# EAGLE design MomoinololuM3[Rev1.1] (EAGLE 6.3)
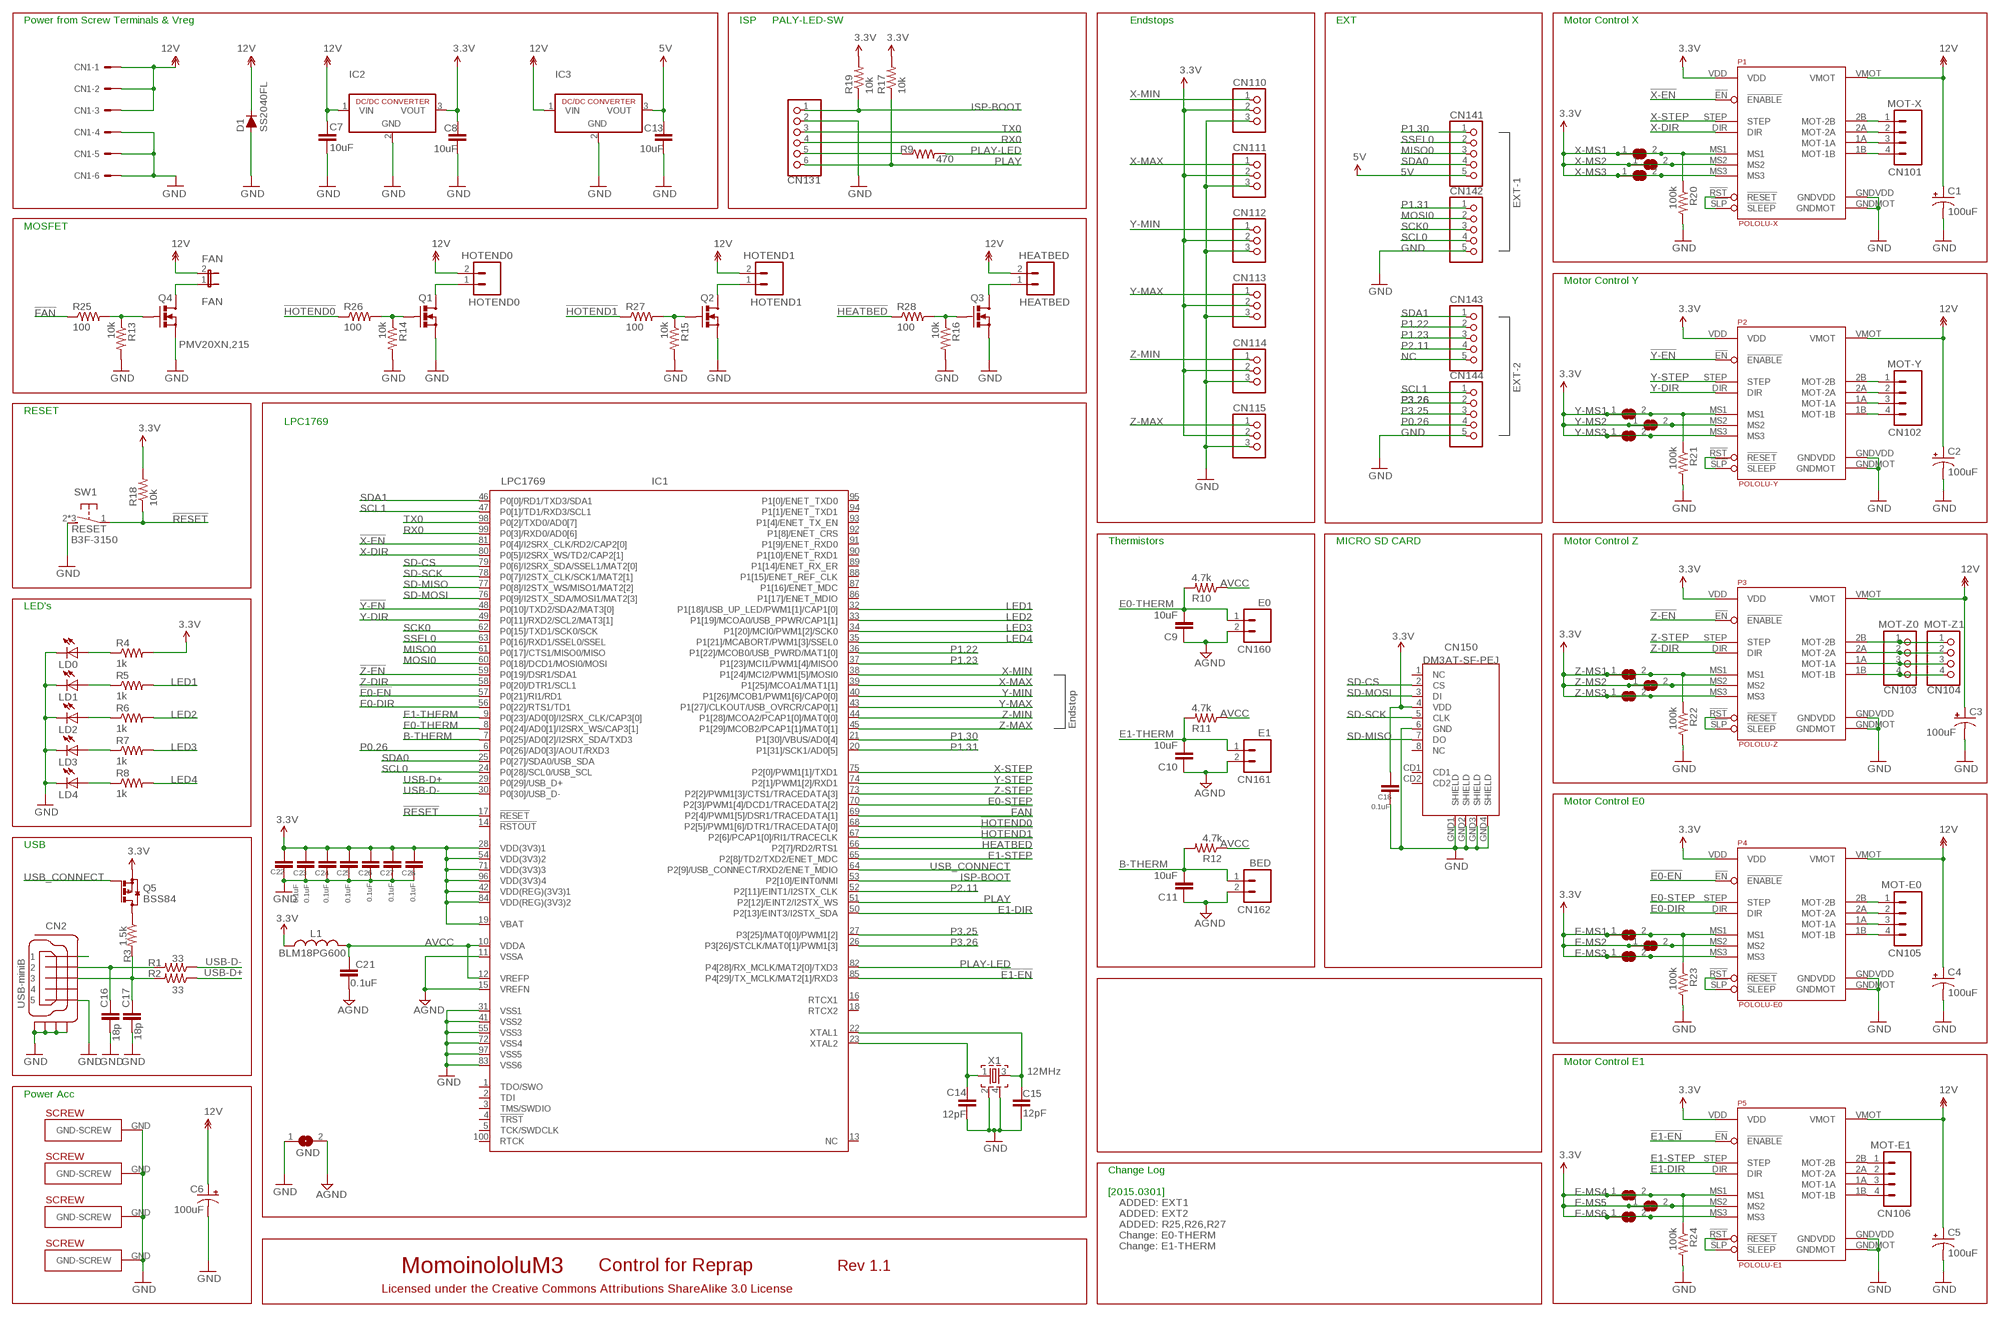
[diagram p0: schematic, sheet 1]

## Parts
C1  100uF  CPOL-USUD-6,3X7,7  [UD-6,3X7,7_NICHICON]
C2  100uF  CPOL-USUD-6,3X7,7  [UD-6,3X7,7_NICHICON]
C3  100uF  CPOL-USUD-6,3X7,7  [UD-6,3X7,7_NICHICON]
C4  100uF  CPOL-USUD-6,3X7,7  [UD-6,3X7,7_NICHICON]
C5  100uF  CPOL-USUD-6,3X7,7  [UD-6,3X7,7_NICHICON]
C6  100uF  CPOL-USUD-6,3X7,7  [UD-6,3X7,7_NICHICON]
C7  10uF  RCL_C-EUC1206K  [RCL_C1206K]
C8  10uF  RCL_C-EUC1206K  [RCL_C1206K]
C9  10uF  RCL_C-EUC1206K  [RCL_C1206K]
C10  10uF  RCL_C-EUC1206K  [RCL_C1206K]
C11  10uF  RCL_C-EUC1206K  [RCL_C1206K]
C13  10uF  RCL_C-EUC1206K  [RCL_C1206K]
C14  12pF  C-EUC0603  [C0603]
C15  12pF  C-EUC0603  [C0603]
C16  18p  C-EUC0603  [C0603]
C17  18p  C-EUC0603  [C0603]
C18  0.1uF  C-EUC0603  [C0603]
C21  0.1uF  C-EUC0603  [C0603]
C22  0.1uF  C-EUC0603  [C0603]
C23  0.1uF  C-EUC0603  [C0603]
C24  0.1uF  C-EUC0603  [C0603]
C25  0.1uF  C-EUC0603  [C0603]
C26  0.1uF  C-EUC0603  [C0603]
C27  0.1uF  C-EUC0603  [C0603]
C28  0.1uF  C-EUC0603  [C0603]
CN1  556X-6H  [5569-6]
CN2  USB-miniB  CON-HIROSE_MINI-USB-SHIELD-UX60A-MB-5ST  [CON-HIROSE_UX60A-MB-5ST]
CN101  MOT-X  SPARKFUN_M04POLAR  [SPARKFUN_MOLEX-1X4]
CN102  MOT-Y  SPARKFUN_M04POLAR  [SPARKFUN_MOLEX-1X4]
CN103  MOT-Z0  PINHD-1X4  [1X04]
CN104  MOT-Z1  PINHD-1X4  [1X04]
CN105  MOT-E0  SPARKFUN_M04POLAR  [SPARKFUN_MOLEX-1X4]
CN106  MOT-E1  SPARKFUN_M04POLAR  [SPARKFUN_MOLEX-1X4]
CN110  PINHD-1X3  [1X03]
CN111  PINHD-1X3  [1X03]
CN112  PINHD-1X3  [1X03]
CN113  PINHD-1X3  [1X03]
CN114  PINHD-1X3  [1X03]
CN115  PINHD-1X3  [1X03]
CN131  PINHD-1X6  [1X06]
CN141  PINHD-1X5  [1X05]
CN142  PINHD-1X5  [1X05]
CN143  PINHD-1X5  [1X05]
CN144  PINHD-1X5  [1X05]
CN150  DM3AT-SF-PEJ  [DM3AT-SF-PEJ]
CN160  E0  SPARKFUN_M02PTH  [SPARKFUN_1X02]
CN161  E1  SPARKFUN_M02PTH  [SPARKFUN_1X02]
CN162  BED  SPARKFUN_M02PTH  [SPARKFUN_1X02]
D1  SS2040FL  SEMICON-SMD-IPC_D-FILL-SOD123  [SEMICON-SMD-IPC_SOD123]
E-MS1  SJ  [SJ]
E-MS2  SJ  [SJ]
E-MS3  SJ  [SJ]
E-MS4  SJ  [SJ]
E-MS5  SJ  [SJ]
E-MS6  SJ  [SJ]
FAN  FAN  SPARKFUN_JUMPER-2PTH  [SPARKFUN_1X02]
GND  SJ  [SJ]
HEATBED  HEATBED  SPARKFUN_M025.08MM  [SCREWTERMINAL-5.08MM-2]
HOLE1  PLATED-SCREW  [PLATEDSCREW]
HOLE2  PLATED-SCREW  [PLATEDSCREW]
HOLE3  PLATED-SCREW  [PLATEDSCREW]
HOLE4  PLATED-SCREW  [PLATEDSCREW]
HOTEND0  HOTEND0  SPARKFUN_M025.08MM  [SCREWTERMINAL-5.08MM-2]
HOTEND1  HOTEND1  SPARKFUN_M025.08MM  [SCREWTERMINAL-5.08MM-2]
IC1  LPC1769  LPC1768  [LQFP100-14X14]
IC2  R-78E3.3-0.5  R-78C3.3-1.0  [SIP3]
IC3  R-78E5.0-0.5  R-78C3.3-1.0  [SIP3]
L1  BLM18PG600  L-USL2012C  [L2012C]
LD0  LEDSML0805  [SML0805]
LD1  LEDSML0805  [SML0805]
LD2  LEDSML0805  [SML0805]
LD3  LEDSML0805  [SML0805]
LD4  LEDSML0805  [SML0805]
P1  POLOLU-X  POLOLU-ALLEGRO_POLOLU-ALLEGRO  [POLOLU-ALLEGRO_POLOLU-ALLEGRO-PTH]
P2  POLOLU-Y  POLOLU-ALLEGRO_POLOLU-ALLEGRO  [POLOLU-ALLEGRO_POLOLU-ALLEGRO-PTH]
P3  POLOLU-Z  POLOLU-ALLEGRO_POLOLU-ALLEGRO  [POLOLU-ALLEGRO_POLOLU-ALLEGRO-PTH]
P4  POLOLU-E0  POLOLU-ALLEGRO_POLOLU-ALLEGRO  [POLOLU-ALLEGRO_POLOLU-ALLEGRO-PTH]
P5  POLOLU-E1  POLOLU-ALLEGRO_POLOLU-ALLEGRO  [POLOLU-ALLEGRO_POLOLU-ALLEGRO-PTH]
Q1  PSMN038-100YLX  SPARKFUN_MOSFET-NCHANNELSOT669  [SOT669]
Q2  PSMN038-100YLX  SPARKFUN_MOSFET-NCHANNELSOT669  [SOT669]
Q3  PSMN038-100YLX  SPARKFUN_MOSFET-NCHANNELSOT669  [SOT669]
Q4  PMV20XN,215  SPARKFUN_MOSFET-NCHANNELSMD  [SPARKFUN_SOT23-3]
Q5  BSS84  [SOT23]
R1  33  R-US_R0603  [R0603]
R2  33  R-US_R0603  [R0603]
R3  1.5k  R-US_R0603  [R0603]
R4  1k  R-US_R0603  [R0603]
R5  1k  R-US_R0603  [R0603]
R6  1k  R-US_R0603  [R0603]
R7  1k  R-US_R0603  [R0603]
R8  1k  R-US_R0603  [R0603]
R9  470  R-US_R0603  [R0603]
R10  4.7k  R-US_R0603  [R0603]
R11  4.7k  R-US_R0603  [R0603]
R12  4.7k  R-US_R0603  [R0603]
R13  10k  R-US_R0603  [R0603]
R14  10k  R-US_R0603  [R0603]
R15  10k  R-US_R0603  [R0603]
R16  10k  R-US_R0603  [R0603]
R17  10k  R-US_R0603  [R0603]
R18  10k  R-US_R0603  [R0603]
R19  10k  R-US_R0603  [R0603]
R20  100k  R-US_R0603  [R0603]
R21  100k  R-US_R0603  [R0603]
R22  100k  R-US_R0603  [R0603]
R23  100k  R-US_R0603  [R0603]
R24  100k  R-US_R0603  [R0603]
R25  100  R-US_R0603  [R0603]
R26  100  R-US_R0603  [R0603]
R27  100  R-US_R0603  [R0603]
R28  100  R-US_R0603  [R0603]
SW1  B3F-3150  31-XX  [B3F-31XX]
X1  12MHz  FA-238  [FA-238]
X-MS1  SJ  [SJ]
X-MS2  SJ  [SJ]
X-MS3  SJ  [SJ]
Y-MS1  SJ  [SJ]
Y-MS2  SJ  [SJ]
Y-MS3  SJ  [SJ]
Z-MS1  SJ  [SJ]
Z-MS2  SJ  [SJ]
Z-MS3  SJ  [SJ]

## Nets
3.3V: C8.1 C18.2 C22.2 C23.2 C24.2 C25.2 C26.2 C27.2 C28.2 CN110.2 CN111.2 CN112.2 CN113.2 CN114.2 CN115.2 CN150.4(VDD) E-MS1.1 E-MS1.2 E-MS2.1 E-MS2.2 E-MS3.1 E-MS3.2 E-MS4.1 E-MS4.2 E-MS5.1 E-MS5.2 E-MS6.1 E-MS6.2 IC1.19(VBAT) IC1.28(VDD(3V3)1) IC1.42(VDD(REG)(3V3)1) IC1.54(VDD(3V3)2) IC1.71(VDD(3V3)3) IC1.84(VDD(REG)(3V3)2) IC1.96(VDD(3V3)4) IC2.3(VOUT) L1.1 P1.MS1 P1.MS2 P1.MS3 P1.VDD P2.MS1 P2.MS2 P2.MS3 P2.VDD P3.MS1 P3.MS2 P3.MS3 P3.VDD P4.MS1 P4.MS2 P4.MS3 P4.VDD P5.MS1 P5.MS2 P5.MS3 P5.VDD Q5.2(S) R4.2 R17.2 R18.2 R19.2 R20.1 R21.1 R22.1 R23.1 R24.1 X-MS1.1 X-MS1.2 X-MS2.1 X-MS2.2 X-MS3.1 X-MS3.2 Y-MS1.1 Y-MS1.2 Y-MS2.1 Y-MS2.2 Y-MS3.1 Y-MS3.2 Z-MS1.1 Z-MS1.2 Z-MS2.1 Z-MS2.2 Z-MS3.1 Z-MS3.2
5V: C13.1 CN141.5 IC3.3(VOUT)
12V: C1.+ C2.+ C3.+ C4.+ C5.+ C6.+ C7.1 CN1.1 CN1.2 CN1.3 D1.1(C) FAN.2 HEATBED.2 HOTEND0.2 HOTEND1.2 IC2.1(VIN) IC3.1(VIN) P1.VMOT P2.VMOT P3.VMOT P4.VMOT P5.VMOT
!E0-EN: IC1.57(P0[21]/RI1/RD1) P4.!EN(!ENABLE)
!E1-EN: IC1.85(P4[29]/TX_MCLK/MAT2[1]/RXD3) P5.!EN(!ENABLE)
!FAN: IC1.69(P2[4]/PWM1[5]/DSR1/TRACEDATA[1]) R25.1
!HEATBED: IC1.66(P2[7]/RD2/RTS1) R28.1
!HOTEND0: IC1.68(P2[5]/PWM1[6]/DTR1/TRACEDATA[0]) R26.1
!HOTEND1: IC1.67(P2[6]/PCAP1[0]/RI1/TRACECLK) R27.1
!RESET: IC1.17(!RESET) R18.1 SW1.1(P)
!X-EN: IC1.81(P0[4]/I2SRX_CLK/RD2/CAP2[0]) P1.!EN(!ENABLE)
!Y-EN: IC1.48(P0[10]/TXD2/SDA2/MAT3[0]) P2.!EN(!ENABLE)
!Z-EN: IC1.59(P0[19]/DSR1/SDA1) P3.!EN(!ENABLE)
AGND: C9.1 C10.1 C11.1 C21.2 CN160.2 CN161.2 CN162.2 GND.2 IC1.11(VSSA) IC1.15(VREFN)
AVCC: C21.1 IC1.10(VDDA) IC1.12(VREFP) L1.2 R10.1 R11.1 R12.1
B-THERM: C11.2 CN162.1 IC1.7(P0[25]/AD0[2]/I2SRX_SDA/TXD3) R12.2
E0-DIR: IC1.56(P0[22]/RTS1/TD1) P4.DIR
E0-STEP: IC1.70(P2[3]/PWM1[4]/DCD1/TRACEDATA[2]) P4.STEP
E0-THERM: C9.2 CN160.1 IC1.8(P0[24]/AD0[1]/I2SRX_WS/CAP3[1]) R10.2
E1-DIR: IC1.50(P2[13]/EINT3/I2STX_SDA) P5.DIR
E1-STEP: IC1.65(P2[8]/TD2/TXD2/ENET_MDC) P5.STEP
E1-THERM: C10.2 CN161.1 IC1.9(P0[23]/AD0[0]/I2SRX_CLK/CAP3[0]) R11.2
E-MOT-1A [power]: CN105.3 P4.1A(MOT-1A)
E-MOT-1A1 [power]: CN106.3 P5.1A(MOT-1A)
E-MOT-1B [power]: CN105.4 P4.1B(MOT-1B)
E-MOT-1B1 [power]: CN106.4 P5.1B(MOT-1B)
E-MOT-2A [power]: CN105.2 P4.2A(MOT-2A)
E-MOT-2A1 [power]: CN106.2 P5.2A(MOT-2A)
E-MOT-2B [power]: CN105.1 P4.2B(MOT-2B)
E-MOT-2B1 [power]: CN106.1 P5.2B(MOT-2B)
E-RESETSLEEP: P4.!RST(!RESET) P4.!SLP(!SLEEP)
E-RESETSLEEP1: P5.!RST(!RESET) P5.!SLP(!SLEEP)
GND: C1.- C2.- C3.- C4.- C5.- C6.- C7.2 C8.2 C13.2 C14.2 C15.2 C16.2 C17.2 C18.1 C22.1 C23.1 C24.1 C25.1 C26.1 C27.1 C28.1 CN1.4 CN1.5 CN1.6 CN2.5 CN2.M1(S1) CN2.M2(S2) CN2.M3(S3) CN2.M4(S4) CN110.3 CN111.3 CN112.3 CN113.3 CN114.3 CN115.3 CN131.2 CN142.5 CN144.5 CN150.6(GND) CN150.GND1(SHIELD) CN150.GND2(SHIELD) CN150.GND3(SHIELD) CN150.GND4(SHIELD) D1.2(A) GND.1 HOLE1.GND(GND-SCREW) HOLE2.GND(GND-SCREW) HOLE3.GND(GND-SCREW) HOLE4.GND(GND-SCREW) IC1.31(VSS1) IC1.41(VSS2) IC1.55(VSS3) IC1.72(VSS4) IC1.83(VSS6) IC1.97(VSS5) IC2.2(GND) IC3.2(GND) LD0.C LD1.C LD2.C LD3.C LD4.C P1.GNDMOT P1.GNDVDD P2.GNDMOT P2.GNDVDD P3.GNDMOT P3.GNDVDD P4.GNDMOT P4.GNDVDD P5.GNDMOT P5.GNDVDD Q1.1(S) Q1.2(S) Q1.3(S) Q2.1(S) Q2.2(S) Q2.3(S) Q3.1(S) Q3.2(S) Q3.3(S) Q4.2(S) R13.2 R14.2 R15.2 R16.2 R20.2 R21.2 R22.2 R23.2 R24.2 SW1.2(S) SW1.3(S) SW1.4(S) X1.2 X1.4
HEATBED-GND: HEATBED.1 Q3.MB(D)
HOTEND0-GND: HOTEND0.1 Q1.MB(D)
HOTEND-GND1: HOTEND1.1 Q2.MB(D)
ISP-BOOT: CN131.1 IC1.53(P2[10]/EINT0/NMI) R19.1
LED0: LD0.A R4.1
LED1: IC1.32(P1[18]/USB_UP_LED/PWM1[1]/CAP1[0]) R5.2
LED2: IC1.33(P1[19]/MCOA0/USB_PPWR/CAP1[1]) R6.2
LED3: IC1.34(P1[20]/MCI0/PWM1[2]/SCK0) R7.2
LED4: IC1.35(P1[21]/MCABORT/PWM1[3]/SSEL0) R8.2
MISO0: CN141.3 IC1.61(P0[17]/CTS1/MISO0/MISO)
MOSI0: CN142.2 IC1.60(P0[18]/DCD1/MOSI0/MOSI)
N$2: Q5.3(D) R3.1
N$3: Q4.1(G) R13.1 R25.2
N$4: Q1.4(G) R14.1 R26.2
N$5: FAN.1 Q4.3(D)
N$6: C16.1 CN2.2 R1.2
N$7: C17.1 CN2.3 R2.2 R3.2
N$8: Q2.4(G) R15.1 R27.2
N$9: CN131.5 R9.1
N$10: LD1.A R5.1
N$11: LD2.A R6.1
N$12: LD3.A R7.1
N$13: LD4.A R8.1
N$14: Q3.4(G) R16.1 R28.2
NC: CN143.5
P0.26: CN144.4 IC1.6(P0[26]/AD0[3]/AOUT/RXD3)
P1.22: CN143.2 IC1.36(P1[22]/MCOB0/USB_PWRD/MAT1[0])
P1.23: CN143.3 IC1.37(P1[23]/MCI1/PWM1[4]/MISO0)
P1.30: CN141.1 IC1.21(P1[30]/VBUS/AD0[4])
P1.31: CN142.1 IC1.20(P1[31]/SCK1/AD0[5])
P2.11: CN143.4 IC1.52(P2[11]/EINT1/I2STX_CLK)
P3.25: CN144.3 IC1.27(P3[25]/MAT0[0]/PWM1[2])
P3.26: CN144.2 IC1.26(P3[26]/STCLK/MAT0[1]/PWM1[3])
PLAY: CN131.6 IC1.51(P2[12]/EINT2/I2STX_WS) R17.1
PLAY-LED: IC1.82(P4[28]/RX_MCLK/MAT2[0]/TXD3) R9.2
RX0: CN131.4 IC1.99(P0[3]/RXD0/AD0[6])
SCK0: CN142.3 IC1.62(P0[15]/TXD1/SCK0/SCK)
SCL0: CN142.4 IC1.24(P0[28]/SCL0/USB_SCL)
SCL1: CN144.1 IC1.47(P0[1]/TD1/RXD3/SCL1)
SD-CS: CN150.2(CS) IC1.79(P0[6]/I2SRX_SDA/SSEL1/MAT2[0])
SD-MISO: CN150.7(DO) IC1.77(P0[8]/I2STX_WS/MISO1/MAT2[2])
SD-MOSI: CN150.3(DI) IC1.76(P0[9]/I2STX_SDA/MOSI1/MAT2[3])
SD-SCK: CN150.5(CLK) IC1.78(P0[7]/I2STX_CLK/SCK1/MAT2[1])
SDA0: CN141.4 IC1.25(P0[27]/SDA0/USB_SDA)
SDA1: CN143.1 IC1.46(P0[0]/RD1/TXD3/SDA1)
SSEL0: CN141.2 IC1.63(P0[16]/RXD1/SSEL0/SSEL)
TX0: CN131.3 IC1.98(P0[2]/TXD0/AD0[7])
USB-D+: IC1.29(P0[29]/USB_D+) R2.1
USB-D-: IC1.30(P0[30]/USB_D-) R1.1
USB_CONNECT: IC1.64(P2[9]/USB_CONNECT/RXD2/ENET_MDIO) Q5.1(G)
VBUS: CN2.1
X'TAL-IN: C15.1 IC1.22(XTAL1) X1.3
X'TAL-OUT: C14.1 IC1.23(XTAL2) X1.1
X-DIR: IC1.80(P0[5]/I2SRX_WS/TD2/CAP2[1]) P1.DIR
X-MAX: CN111.1 IC1.39(P1[25]/MCOA1/MAT1[1])
X-MIN: CN110.1 IC1.38(P1[24]/MCI2/PWM1[5]/MOSI0)
X-MOT-1A [power]: CN101.3 P1.1A(MOT-1A)
X-MOT-1B [power]: CN101.4 P1.1B(MOT-1B)
X-MOT-2A [power]: CN101.2 P1.2A(MOT-2A)
X-MOT-2B [power]: CN101.1 P1.2B(MOT-2B)
X-RESETSLEEP: P1.!RST(!RESET) P1.!SLP(!SLEEP)
X-STEP: IC1.75(P2[0]/PWM1[1]/TXD1) P1.STEP
Y-DIR: IC1.49(P0[11]/RXD2/SCL2/MAT3[1]) P2.DIR
Y-MAX: CN113.1 IC1.43(P1[27]/CLKOUT/USB_OVRCR/CAP0[1])
Y-MIN: CN112.1 IC1.40(P1[26]/MCOB1/PWM1[6]/CAP0[0])
Y-MOT-1A [power]: CN102.3 P2.1A(MOT-1A)
Y-MOT-1B [power]: CN102.4 P2.1B(MOT-1B)
Y-MOT-2A [power]: CN102.2 P2.2A(MOT-2A)
Y-MOT-2B [power]: CN102.1 P2.2B(MOT-2B)
Y-RESETSLEEP: P2.!RST(!RESET) P2.!SLP(!SLEEP)
Y-STEP: IC1.74(P2[1]/PWM1[2]/RXD1) P2.STEP
Z-DIR: IC1.58(P0[20]/DTR1/SCL1) P3.DIR
Z-MAX: CN115.1 IC1.45(P1[29]/MCOB2/PCAP1[1]/MAT0[1])
Z-MIN: CN114.1 IC1.44(P1[28]/MCOA2/PCAP1[0]/MAT0[0])
Z-MOT-1A [power]: CN103.3 CN104.3 P3.1A(MOT-1A)
Z-MOT-1B [power]: CN103.4 CN104.4 P3.1B(MOT-1B)
Z-MOT-2A [power]: CN103.2 CN104.2 P3.2A(MOT-2A)
Z-MOT-2B [power]: CN103.1 CN104.1 P3.2B(MOT-2B)
Z-RESETSLEEP: P3.!RST(!RESET) P3.!SLP(!SLEEP)
Z-STEP: IC1.73(P2[2]/PWM1[3]/CTS1/TRACEDATA[3]) P3.STEP
Unconnected: CN2.4 CN150.1(NC) CN150.8(NC) CN150.CD1 CN150.CD2 IC1.1(TDO/SWO) IC1.2(TDI) IC1.3(TMS/SWDIO) IC1.4(!TRST) IC1.5(TCK/SWDCLK) IC1.13(NC) IC1.14(!RSTOUT) IC1.16(RTCX1) IC1.18(RTCX2) IC1.86(P1[17]/ENET_MDIO) IC1.87(P1[16]/ENET_MDC) IC1.88(P1[15]/ENET_REF_CLK) IC1.89(P1[14]/ENET_RX_ER) IC1.90(P1[10]/ENET_RXD1) IC1.91(P1[9]/ENET_RXD0) IC1.92(P1[8]/ENET_CRS) IC1.93(P1[4]/ENET_TX_EN) IC1.94(P1[1]/ENET_TXD1) IC1.95(P1[0]/ENET_TXD0) IC1.100(RTCK)

## Notes on the sheet
- Power from Screw Terminals & Vreg | ISP | PALY-LED-SW | Endstops | EXT | Motor Control X
- EXT-1
- MOSFET
- Motor Control Y
- EXT-2
- RESET
- LPC1769
- RESET
- Thermistors | MICRO SD CARD | Motor Control Z
- LED's
- Endstop
- Motor Control E0
- USB
- Motor Control E1
- Power Acc
- Change Log
- [2015.0301]
- ADDED: EXT1
- ADDED: EXT2
- ADDED: R25,R26,R27
- Change: E0-THERM
- Change: E1-THERM
- MomoinololuM3 | Control for Reprap | Rev 1.1
- Licensed under the Creative Commons Attributions ShareAlike 3.0 License

## Library data of the parts
C1-C6 = rcl:CPOL-US: POLARIZED CAPACITOR, American symbol
C7-C11 C13 = Sanguinololu:RCL_C-EU: CAPACITOR, European symbol
C14-C18 C21-C28 = momoinololuM3:C-EU: CAPACITOR, European symbol
CN1 = con-molex-2:556X-6: Mini FIT JR connector 6 way
CN2 = Sanguinololu:CON-HIROSE_MINI-USB-SHIELD-: MINI USB Connector Source: http://www.hirose.co.jp/cataloge_hp/e24000019.pdf; OC_FARNELL: unknown; OC_NEWARK: unknown
CN101 CN102 CN105 CN106 = Sanguinololu:SPARKFUN_M04: Header 4 Standard 4-pin 0.1" header. Use with straight break away headers (SKU : PRT-00116), right angle break away headers (PRT-00553), swiss pins (PRT-00743), machine pins (PRT-00117), and female headers (PRT-00115). Molex polarized connector foot print use with SKU : PRT-08231 with associated crimp pins and housings.
CN103 CN104 = Sanguinololu:PINHD-1X4: PIN HEADER
CN110-CN115 = momoinololuM3:PINHD-1X3: PIN HEADER
CN131 = momoinololuM3:PINHD-1X6: PIN HEADER
CN141-CN144 = momoinololuM3:PINHD-1X5: PIN HEADER
CN150 = sd-card:DM3AT-SF-PEJ: HIROSE microSD socket DM3AT-SF-PEJ
CN160-CN162 = momoinololuM3:SPARKFUN_M02: Header 2 Standard 2-pin 0.1" header. Use with straight break away headers (SKU : PRT-00116), right angle break away headers (PRT-00553), swiss pins (PRT-00743), machine pins (PRT-00117), and female headers (PRT-00115). Molex polarized connector foot print use with SKU : PRT-08233 with associated crimp pins and housings.
D1 = Sanguinololu:SEMICON-SMD-IPC_D-FILL-: DIODE filled
E-MS1-E-MS6 GND X-MS1-X-MS3 Y-MS1-Y-MS3 Z-MS1-Z-MS3 = Sanguinololu:SJ: SMD solder JUMPER
FAN = Sanguinololu:SPARKFUN_JUMPER-2: Jumper Basic 0.1" spaced jumper. Use with breakaway headers.
HEATBED HOTEND0 HOTEND1 = Sanguinololu:SPARKFUN_M02: Header 2 Standard 2-pin 0.1" header. Use with straight break away headers (SKU : PRT-00116), right angle break away headers (PRT-00553), swiss pins (PRT-00743), machine pins (PRT-00117), and female headers (PRT-00115). Molex polarized connector foot print use with SKU : PRT-08233 with associated crimp pins and housings.
HOLE1-HOLE4 = momoinololuM3:PLATED-SCREW
IC1 = lpc1xxx-v6:LPC1768: LPC1768 100 MHz 32-bit ARM Cortex-M3 based microcontroller featuring a high level of integration and low power consumption. 512 kB Flash, 64 kB SRAM, USB Device/Host/OTG, 2 CAN, DAC, Ethernet MarcVl - Datasheet available on www.nxp.com
IC2 IC3 = momoinololuM3:R-78C*-1.0: INNOLINE DC/DC-Converter 1.0 AMP SIP3 Single Output Source: Data sheet <http://www.mikrocontroller.net/attachment/150645/157764-da-01-en-DC_DC_WANDLER_R_78C5_0_1_0.pdf>
L1 = rcl:L-US: INDUCTOR, American symbol
LD0 LD1-LD4 = led:LED: LED OSRAM: - CHIPLED LG R971, LG N971, LY N971, LG Q971, LY Q971, LO R971, LY R971 LH N974, LH R974 LS Q976, LO Q976, LY Q976 LO Q996 - Hyper CHIPLED LW Q18S LB Q993, LB Q99A, LB R99A - SideLED LS A670, LO A670, LY A670, LG A670, LP A670 LB A673, LV A673, LT A673, LW A673 LH A674 LY A675 LS A676, LA A676, LO A676, LY A676, LW A676 LS A679, LY A679, LG A679 - Hyper Micro SIDELED® LS Y876, LA Y876, LO Y876, LY Y876 LT Y87S - SmartLED LW L88C, LW L88S LB L89C, LB L89S, LG L890 LS L89K, LO L89K, LY L89K LS L896, LA L896, LO L896, LY L896 - TOPLED LS T670, LO T670, LY T670, LG T670, LP T670 LSG T670, LSP T670, LSY T670, LOP T670, LYG T670 LG T671, LOG T671, LSG T671 LB T673, LV T673, LT T673, LW T673 LH T674 LS T676, LA T676, LO T676, LY T676, LB T676, LH T676, LSB T676, LW T676 LB T67C, LV T67C, LT T67C, LS T67K, LO T67K, LY T67K, LW E67C LS E67B, LA E67B, LO E67B, LY E67B, LB E67C, LV E67C, LT E67C LW T67C LS T679, LY T679, LG T679 LS T770, LO T770, LY T770, LG T770, LP T770 LB T773, LV T773, LT T773, LW T773 LH T774 LS E675, LA E675, LY E675, LS T675 LS T776, LA T776, LO T776, LY T776, LB T776 LHGB T686 LT T68C, LB T68C - Hyper Mini TOPLED® LB M676 - Mini TOPLED Santana® LG M470 LS M47K, LO M47K, LY M47K Source: http://www.osram.convergy.de LUXEON: - LUMILED® LXK2-PW12-R00, LXK2-PW12-S00, LXK2-PW14-U00, LXK2-PW14-V00 LXK2-PM12-R00, LXK2-PM12-S00, LXK2-PM14-U00 LXK2-PE12-Q00, LXK2-PE12-R00, LXK2-PE12-S00, LXK2-PE14-T00, LXK2-PE14-U00 LXK2-PB12-K00, LXK2-PB12-L00, LXK2-PB12-M00, LXK2-PB14-N00, LXK2-PB14-P00, LXK2-PB14-Q00 LXK2-PR12-L00, LXK2-PR12-M00, LXK2-PR14-Q00, LXK2-PR14-R00 LXK2-PD12-Q00, LXK2-PD12-R00, LXK2-PD12-S00 LXK2-PH12-R00, LXK2-PH12-S00 LXK2-PL12-P00, LXK2-PL12-Q00, LXK2-PL12-R00 Source: www.luxeon.com KINGBRIGHT: KA-3528ASYC Source: www.kingbright.com
P1-P5 = Sanguinololu:POLOLU-ALLEGRO_POLOLU-ALLEGRO
Q1-Q3 = Sanguinololu:SPARKFUN_MOSFET-NCHANNEL
Q4 = momoinololuM3:SPARKFUN_MOSFET-NCHANNEL
Q5 = momoinololuM3:BSS84: P-CHANNEL MOS FET
R1-R28 = rcl:R-US_: RESISTOR, American symbol
SW1 = momoinololuM3:31-XX: OMRON SWITCH; MPN: B3F-3100; OC_FARNELL: 959704; OC_NEWARK: 36M3582
X1 = Sanguinololu:FA-: MHz RANGE CRYSTAL UNIT Source: Epson Toyocom

## Board
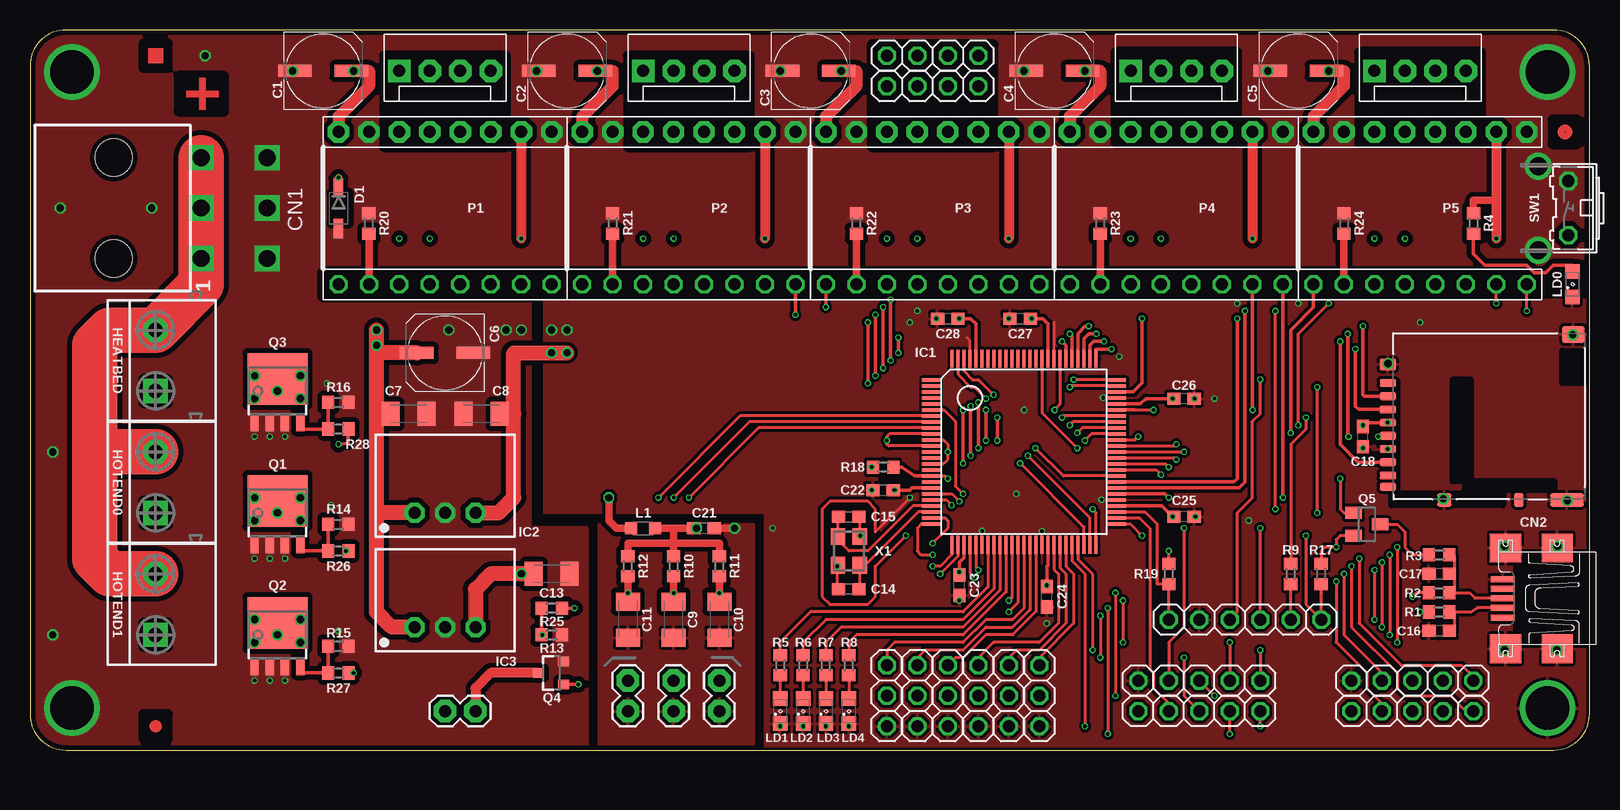
[diagram p1: board, top side]
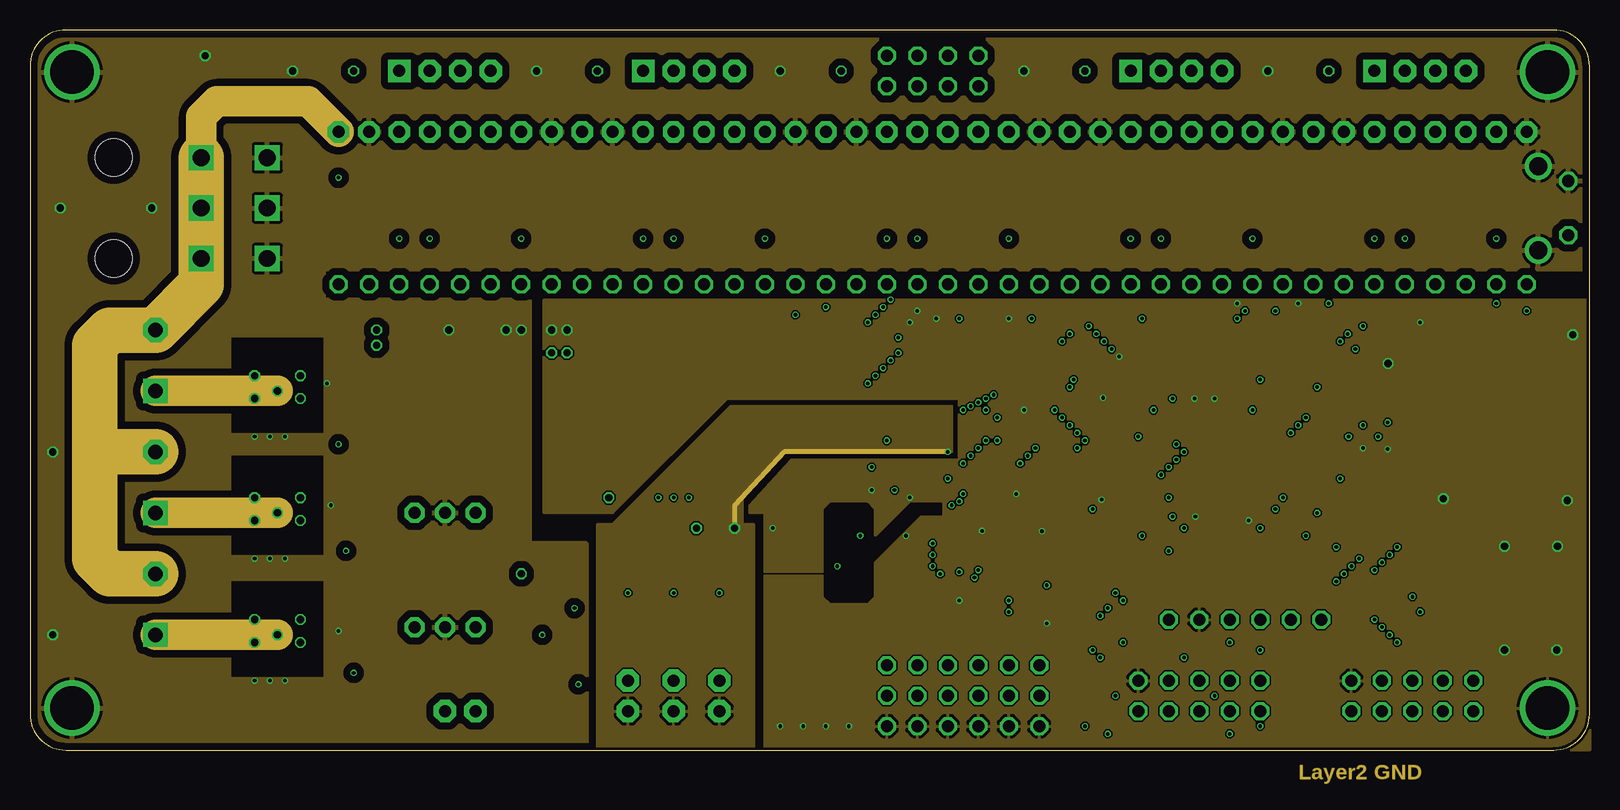
[diagram p2: board, inner layer Layer2_GND]
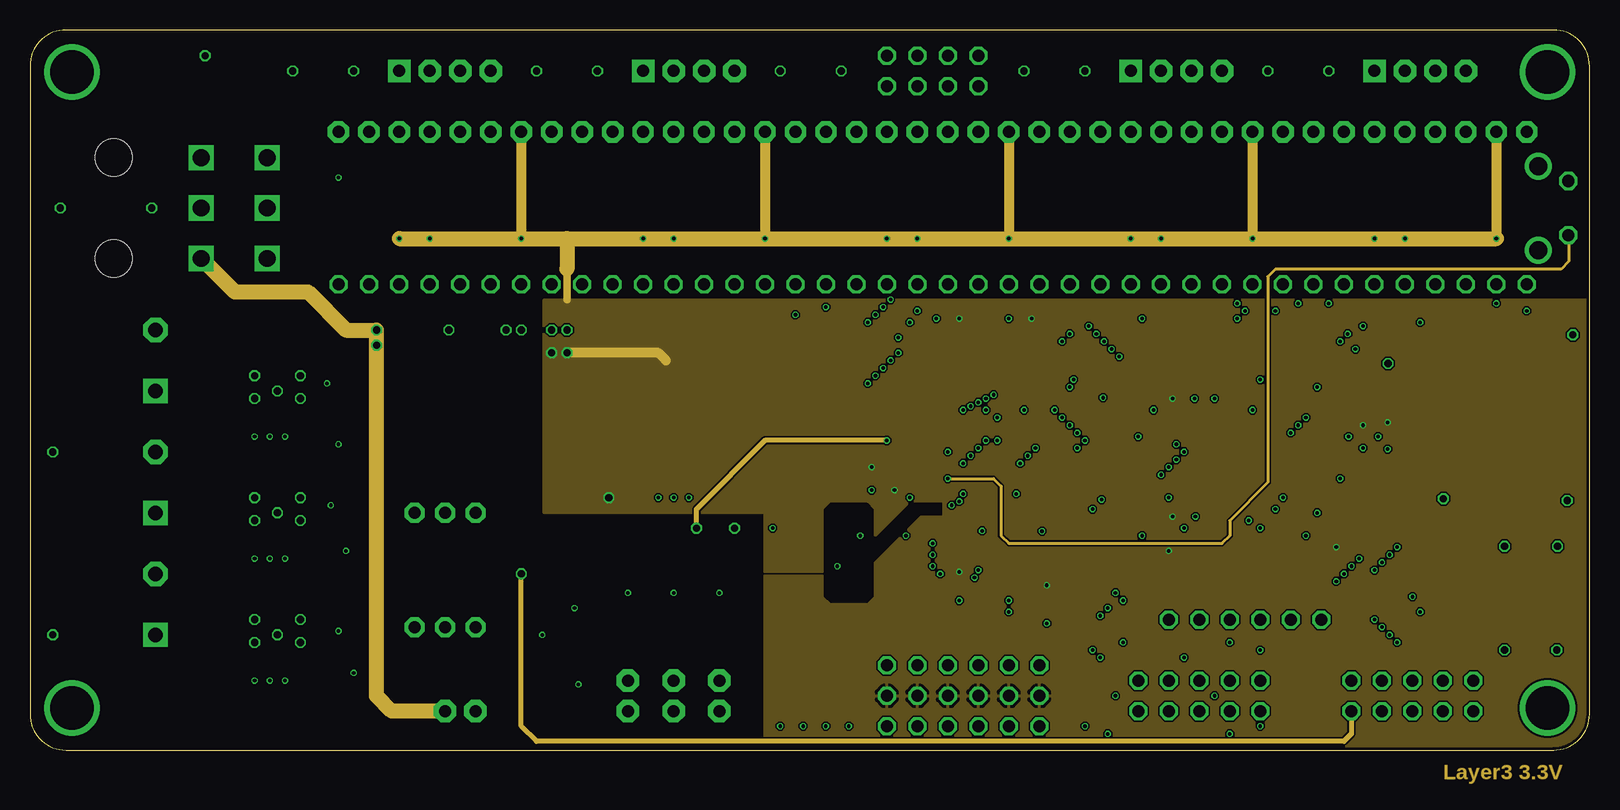
[diagram p3: board, inner layer Layer3_3.3V]
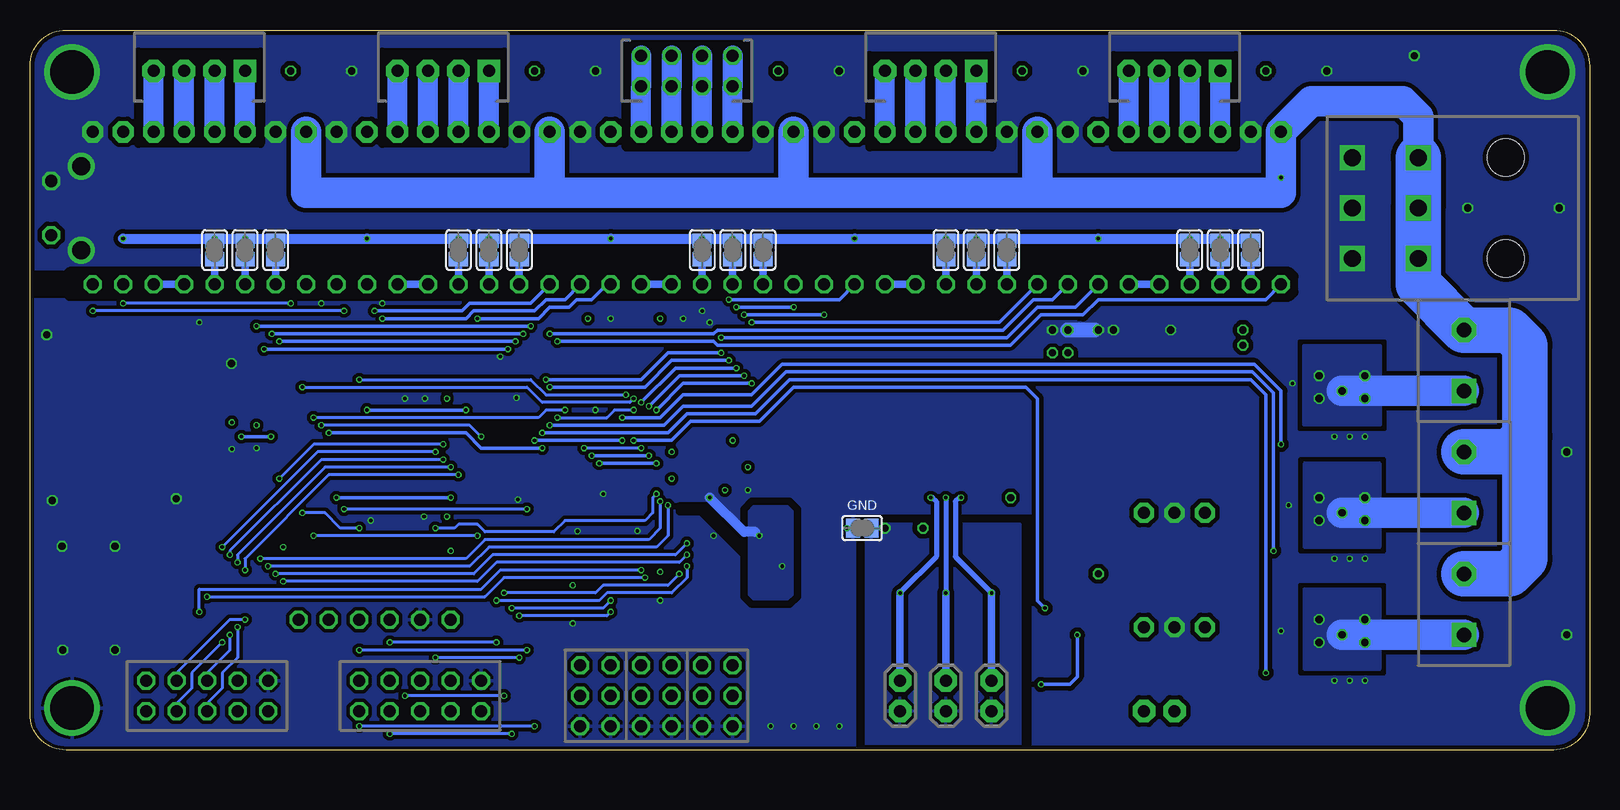
[diagram p4: board, bottom side, seen from below]

Size 130 x 60 mm. Coordinates in mm from the lower left corner, seen from the top.
Outline: 127,0 arc90 130,3
Outline: 130,57 arc90 127,60
Outline: 3,60 arc90 0,57
Outline: 0,3 arc90 3,0
Outline: 3,0 127,0
Outline: 127,0 arc90 130,3
Outline: 130,3 130,57
Outline: 130,57 arc90 127,60
Outline: 127,60 3,60
Outline: 3,60 arc90 0,57
Outline: 0,57 0,3
Outline: 0,3 arc90 3,0
Copper layers (1*2*15*16): Top 0.035mm / dielectric 0.2mm / Layer2_GND 0.0175mm / dielectric 0.3mm / Layer3_3.3V 0.0175mm / dielectric 0.2mm / Bottom 0.035mm
Design rules "4layer": minimum track width 8mil, minimum drill 0.3mm, track to track 6mil, track to pad 6mil, pad to pad 6mil, via to via 6mil, smd to smd 0mil, copper to edge 10mil, drill to drill 8mil, minimum pad ring 6mil, minimum via ring 4mil, stop-mask expansion 4mil, vias tented up to drill 100mil, thermal gap 10mil
tKeepout: 8 lines
tRestrict: area 29.5,50.2 to 39.7,57.9; area 49.8,50.2 to 60,57.9; area 90.5,50.6 to 100.6,58.2; area 70.2,50.2 to 80.3,58.8; area 25.1,43.9 to 26.6,46.4; area 9.5,1 to 11.5,3; area 110.8,50.6 to 121,58.2; area 66.7,12.5 to 69.8,20.4; area 9.5,56.8 to 11.5,58.9; area 126.9,50.5 to 129,52.5; 40 lines
bRestrict: area 70.1,50.2 to 80.3,58.8; area 90.5,50.5 to 100.6,58.2; area 29.5,50.2 to 39.7,57.9; area 49.8,50.3 to 60,57.9; area 110.8,50.5 to 120.9,58.2; 21 lines

### Footprints (pad centres in the part's own frame; a part is rotated, then mirrored left to right if it is on the bottom)
UD-6,3X7,7_NICHICON = smd 2.8 x 1: + 2.35,0; - -2.35,0
RCL_C1206K = smd 1.5 x 2: 1 -1.5,0; 2 1.5,0
C0603 = smd 1.1 x 1: 1 -0.85,0; 2 0.85,0
5569-6 = drill 1.4 square: 1 4.2,0; 2 0,0; 3 -4.2,0; 4 4.2,5.5; 5 0,5.5; 6 -4.2,5.5 | hole 3.1: 4.2,-7.3; -4.2,-7.3
CON-HIROSE_UX60A-MB-5ST = smd 2 x 0.5: 1 2.25,1.6; 2 2.25,0.8; 3 2.25,0; 4 2.25,-0.8; 5 2.25,-1.6 | smd 2.6 x 2.4: M1 -2.3,-4.2; M2 -2.3,4.2; M3 2,4.2; M4 2,-4.2
SPARKFUN_MOLEX-1X4 = drill 1 pad 1.88 square: 1 0,0 | drill 1 pad 1.88 octagon: 2 2.54,0; 3 5.08,0; 4 7.62,0
1X04 = drill 1 octagon: 1 -3.81,0; 2 -1.27,0; 3 1.27,0; 4 3.81,0
1X03 = drill 1 octagon: 1 -2.54,0; 2 0,0; 3 2.54,0
1X06 = drill 1 octagon: 1 -6.35,0; 2 -3.81,0; 3 -1.27,0; 4 1.27,0; 5 3.81,0; 6 6.35,0
1X05 = drill 1 octagon: 1 -5.08,0; 2 -2.54,0; 3 0,0; 4 2.54,0; 5 5.08,0
DM3AT-SF-PEJ = smd 0.65 x 1.4: 1 3.2,16.4; 2 2.1,16.4; 3 1,16.4; 4 -0.1,16.4; 5 -1.2,16.4; 6 -2.3,16.4; 7 -3.4,16.4; 8 -4.5,16.4; CD1 -5.45,16.4 | smd 1.1 x 0.8: CD2 -6.55,5.5 | smd 1.1 x 2.8: GND1 -6.55,1.475 | smd 1.4 x 1.9: GND2 7.25,0.95 | smd 1 x 1.4: GND3 4.75,16.4 | smd 1.1 x 1.2: GND4 -6.55,11.7
SPARKFUN_1X02 = drill 1 pad 1.88 octagon: 1 0,0; 2 2.54,0
SEMICON-SMD-IPC_SOD123 = smd 1.6 x 0.8: 1 -1.7,0; 2 1.7,0
SJ = smd 1.168 x 1.6: 1 -0.762,0; 2 0.762,0
SCREWTERMINAL-5.08MM-2 = drill 1.2 pad 2.032 square: 1 -2.54,0 | drill 1.2 pad 2.032 octagon: 2 2.54,0
PLATEDSCREW = drill 3.6: GND 0,0
LQFP100-14X14 = smd 0.27 x 1.5: 1 -6,-7.75; 2 -5.5,-7.75; 3 -5,-7.75; 4 -4.5,-7.75; 5 -4,-7.75; 6 -3.5,-7.75; 7 -3,-7.75; 8 -2.5,-7.75; 9 -2,-7.75; 10 -1.5,-7.75; 11 -1,-7.75; 12 -0.5,-7.75; 13 0,-7.75; 14 0.5,-7.75; 15 1,-7.75; 16 1.5,-7.75; 17 2,-7.75; 18 2.5,-7.75; 19 3,-7.75; 20 3.5,-7.75; 21 4,-7.75; 22 4.5,-7.75; 23 5,-7.75; 24 5.5,-7.75; 25 6,-7.75; 51 6,7.75; 52 5.5,7.75; 53 5,7.75; 54 4.5,7.75; 55 4,7.75; 56 3.5,7.75; 57 3,7.75; 58 2.5,7.75; 59 2,7.75; 60 1.5,7.75; 61 1,7.75; 62 0.5,7.75; 63 0,7.75; 64 -0.5,7.75; 65 -1,7.75; 66 -1.5,7.75; 67 -2,7.75; 68 -2.5,7.75; 69 -3,7.75; 70 -3.5,7.75; 71 -4,7.75; 72 -4.5,7.75; 73 -5,7.75; 74 -5.5,7.75; 75 -6,7.75 | smd 1.5 x 0.27: 26 7.75,-6; 27 7.75,-5.5; 28 7.75,-5; 29 7.75,-4.5; 30 7.75,-4; 31 7.75,-3.5; 32 7.75,-3; 33 7.75,-2.5; 34 7.75,-2; 35 7.75,-1.5; 36 7.75,-1; 37 7.75,-0.5; 38 7.75,0; 39 7.75,0.5; 40 7.75,1; 41 7.75,1.5; 42 7.75,2; 43 7.75,2.5; 44 7.75,3; 45 7.75,3.5; 46 7.75,4; 47 7.75,4.5; 48 7.75,5; 49 7.75,5.5; 50 7.75,6; 76 -7.75,6; 77 -7.75,5.5; 78 -7.75,5; 79 -7.75,4.5; 80 -7.75,4; 81 -7.75,3.5; 82 -7.75,3; 83 -7.75,2.5; 84 -7.75,2; 85 -7.75,1.5; 86 -7.75,1; 87 -7.75,0.5; 88 -7.75,0; 89 -7.75,-0.5; 90 -7.75,-1; 91 -7.75,-1.5; 92 -7.75,-2; 93 -7.75,-2.5; 94 -7.75,-3; 95 -7.75,-3.5; 96 -7.75,-4; 97 -7.75,-4.5; 98 -7.75,-5; 99 -7.75,-5.5; 100 -7.75,-6
SIP3 = drill 1 pad 1.676 octagon: 1 -2.54,0; 2 0,0; 3 2.54,0
L2012C = smd 1 x 1: 1 -1,0; 2 1,0
SML0805 = smd 1.2 x 1.2: A 1.05,0; C -1.05,0
POLOLU-ALLEGRO_POLOLU-ALLEGRO-PTH = drill 1 pad 1.778 octagon: 1A 6.35,-1.27; 1B 6.35,-3.81; 2A 6.35,1.27; 2B 6.35,3.81; GNDMOT 6.35,6.35; GNDVDD 6.35,-8.89; VDD 6.35,-6.35; VMOT 6.35,8.89 | drill 1 octagon: !EN -6.35,8.89; !RST -6.35,-1.27; !SLP -6.35,-3.81; DIR -6.35,-8.89; MS1 -6.35,6.35; MS2 -6.35,3.81; MS3 -6.35,1.27; STEP -6.35,-6.35
SOT669 = smd 0.7 x 1.4: 1 -1.905,-2.65; 2 -0.635,-2.65; 3 0.635,-2.65; 4 1.905,-2.65 | smd 5 x 4.3: MB 0,1
SPARKFUN_SOT23-3 = smd 0.8 x 0.9: 1 -0.95,-1; 2 0.95,-1; 3 0,1.1
SOT23 = smd 1 x 1.4: 1 -0.95,-1.1; 2 0.95,-1.1; 3 0,1.1
R0603 = smd 1 x 1.1: 1 -0.85,0; 2 0.85,0
B3F-31XX = drill 1.016 octagon: 1 -2.261,-1.245; 2 2.261,-1.245 | drill 1.499 pad 2.159: 3 -3.505,1.245; 4 3.505,1.245
FA-238 = smd 1.4 x 1.2: 1 -1.2,-0.9; 2 1.2,-0.9; 3 1.2,0.9; 4 -1.2,0.9

### Placement (x,y rotation side)
C1  24.44,56.59 0 top
C2  44.76,56.59 0 top
C3  65.08,56.59 0 top
C4  85.4,56.59 0 top
C5  105.72,56.59 0 top
C6  34.6,33.09 180 top
C7  31.55,28.02 0 top
C8  37.65,28.02 180 top
C9  53.65,10.87 90 top
C10  57.46,10.87 90 top
C11  49.84,10.87 90 top
C13  43.49,14.68 0 top
C14  68.25,13.41 180 top
C15  68.25,19.44 0 top
C16  117.47,9.92 180 top
C17  117.47,14.68 180 top
C18  111.12,26.11 90 top
C21  56.19,18.49 0 top
C22  71.11,21.66 0 top
C23  77.46,13.73 90 top
C24  84.77,12.77 90 top
C25  96.19,19.44 180 top
C26  96.19,29.29 180 top
C27  82.54,35.95 0 top
C28  76.51,35.95 0 top
CN1  14.28,45.16 270 top
CN2  125,12.64 180 top
CN101  30.79,56.59 0 top
CN102  51.11,56.59 0 top
CN103  75.24,55.32 0 top
CN104  75.24,57.86 0 top
CN105  91.75,56.59 0 top
CN106  112.07,56.59 0 top
CN110  71.43,4.52 270 top
CN111  73.97,4.52 270 top
CN112  76.51,4.52 270 top
CN113  79.05,4.52 270 top
CN114  81.59,4.52 270 top
CN115  84.13,4.52 270 top
CN131  101.28,10.87 0 top
CN141  115.25,3.25 180 top
CN142  115.25,5.79 180 top
CN143  97.47,3.25 180 top
CN144  97.47,5.79 180 top
CN150  129.6,27.38 90 top
CN160  53.65,5.79 270 top
CN161  57.46,5.79 270 top
CN162  49.84,5.79 270 top
D1  25.71,45.16 270 top
E-MS1  89.21,41.67 270 bottom
E-MS2  91.75,41.67 270 bottom
E-MS3  94.29,41.67 270 bottom
E-MS4  109.53,41.67 270 bottom
E-MS5  112.07,41.67 270 bottom
E-MS6  114.61,41.67 270 bottom
FAN  37.14,3.25 180 top
GND  60.63,18.49 0 bottom
HEATBED  10.47,32.46 90 top
HOLE1  3.5,56.5 0 top
HOLE2  3.5,3.5 0 top
HOLE3  126.5,3.5 0 top
HOLE4  126.5,56.5 0 top
HOTEND0  10.47,22.3 90 top
HOTEND1  10.47,12.14 90 top
IC1  82.86,24.84 270 top
IC2  34.6,19.76 0 top
IC3  34.6,10.23 0 top
L1  51.11,18.49 0 top
LD0  128.58,38.81 90 top
LD1  62.54,3.25 90 top
LD2  64.44,3.25 90 top
LD3  66.35,3.25 90 top
LD4  68.25,3.25 90 top
P1  34.6,45.16 90 top
P2  54.92,45.16 90 top
P3  75.24,45.16 90 top
P4  95.56,45.16 90 top
P5  115.88,45.16 90 top
Q1  20.63,19.76 0 top
Q2  20.63,9.6 0 top
Q3  20.63,29.92 0 top
Q4  43.49,6.43 90 top
Q5  111.44,18.81 270 top
R1  117.47,11.5 0 top
R2  117.47,13.09 0 top
R3  117.47,16.27 0 top
R4  120.33,43.89 90 top
R5  62.54,7.06 90 top
R6  64.44,7.06 90 top
R7  66.35,7.06 90 top
R8  68.25,7.06 90 top
R9  105.09,14.68 90 top
R10  53.65,15.32 270 top
R11  57.46,15.32 270 top
R12  49.84,15.32 270 top
R13  43.49,9.6 0 top
R14  25.71,18.81 0 top
R15  25.71,8.65 0 top
R16  25.71,28.97 0 top
R17  107.62,14.68 90 top
R18  71.11,23.57 180 top
R19  94.92,14.68 90 top
R20  28.25,43.89 90 top
R21  48.57,43.89 90 top
R22  68.89,43.89 90 top
R23  89.21,43.89 90 top
R24  109.53,43.89 90 top
R25  43.49,11.82 180 top
R26  25.71,16.59 180 top
R27  25.71,6.43 180 top
R28  25.71,26.74 180 top
SW1  126.99,45.16 90 top
X1  68.25,16.59 90 top
X-MS1  28.25,41.67 270 bottom
X-MS2  30.79,41.67 270 bottom
X-MS3  33.33,41.67 270 bottom
Y-MS1  48.57,41.67 270 bottom
Y-MS2  51.11,41.67 270 bottom
Y-MS3  53.65,41.67 270 bottom
Z-MS1  68.89,41.67 270 bottom
Z-MS2  71.43,41.67 270 bottom
Z-MS3  73.97,41.67 270 bottom

### Tracks (layer width: path | path; a pad name or v marks a point on that pad's centre or on a via)
3.3V  (via drill 0.3, 0.6)
  Top 0.203: v72.06,21.66 C22.2 | C28.2 v77.46,35.95
  Top 0.254: 107.62,15.32 R17.2 107.62,16.59 107.94,16.9 v108.9,16.9 108.9,17.54 109.22,17.86 Q5.2 | R19.2 v94.92,16.59
  Top 0.305: IC1.42 84.86,15.41 84.77,15.32 C24.2 v84.77,13.73 | C23.2 v77.46,14.84 77.46,15.63 77.86,16.03 IC1.28 | C25.2 v95.24,19.44 94.34,20.34 IC1.54 | C26.2 v95.24,29.29 93.02,29.29 92.58,28.84 IC1.71 | R18.2 v70.16,23.57 | IC1.19 73.51,21.84 73.34,21.66 v72.06,21.66 | C18.2 v111.12,27.06 111.34,27.28 CN150.4 | C27.2 v83.5,35.95 84.45,35.95 84.86,35.54 IC1.84 | IC1.96 78.86,35.51 78.41,35.95 v77.46,35.95
  Top 0.61: R20.1 P1.MS1 | R21.1 P2.MS1 | R22.1 P3.MS1 | R23.1 P4.MS1 | R24.1 P5.MS1 | R4.2 120.33,45.8 122.23,45.8 | L1.1 48.89,18.49 48.25,19.12 v48.25,21.03
  Top 0.813: P1.VDD v40.95,42.62 | P2.VDD v61.27,42.62 | P3.VDD v81.59,42.62 | P4.VDD v101.91,42.62 | P5.VDD 122.23,45.8 v122.23,42.62
  Top 1.27: IC2.3 39.05,19.76 40.31,21.03 40.31,28.02 | 40.31,28.02 C8.1 | 40.31,28.02 40.31,33.09 v44.76,33.09
  Layer3_3.3V 0.61: 44.76,40.08 44.76,37.54
  Layer3_3.3V 0.813: 53.02,32.46 52.38,33.09 v44.76,33.09 | P1.VDD v40.95,42.62 | P2.VDD v61.27,42.62 | P3.VDD v81.59,42.62 | P4.VDD v101.91,42.62 | P5.VDD v122.23,42.62
  Layer3_3.3V 1.27: v30.79,42.62 v40.95,42.62 44.76,42.62 | 44.76,42.62 v61.27,42.62 v81.59,42.62 v101.91,42.62 v122.23,42.62 | 44.76,42.62 44.76,40.08
  Bottom 0.203: E-MS6.1 v114.61,42.62
  Bottom 0.305: E-MS6.1 E-MS6.2 | E-MS5.2 E-MS5.1 | E-MS4.2 E-MS4.1 109.66,42.43 109.85,42.62 | E-MS3.2 E-MS3.1 | E-MS2.2 E-MS2.1 | E-MS1.2 E-MS1.1 | Z-MS3.2 Z-MS3.1 | Z-MS2.2 Z-MS2.1 | Z-MS1.2 Z-MS1.1 | Y-MS3.2 Y-MS3.1 | Y-MS2.2 v51.11,42.62 | Y-MS1.2 Y-MS1.1 | X-MS3.2 X-MS3.1 | X-MS2.2 X-MS2.1 | X-MS1.2 X-MS1.1
  Bottom 0.61: P1.MS1 X-MS1.2 | P1.MS2 X-MS2.2 | P1.MS3 X-MS3.2 | P2.MS1 Y-MS1.2 | P2.MS2 Y-MS2.2 | P2.MS3 Y-MS3.2 | P3.MS1 Z-MS1.2 | P3.MS2 Z-MS2.2 | P3.MS3 Z-MS3.2 | P4.MS1 E-MS1.2 | P4.MS2 E-MS2.2 | P4.MS3 E-MS3.2 | P5.MS2 E-MS5.2 | E-MS5.1 v112.07,42.62 | E-MS3.1 v94.29,42.62 | E-MS2.1 v91.75,42.62 | E-MS1.1 89.21,42.62 | Z-MS3.1 v73.97,42.62 | Z-MS2.1 v71.43,42.62 | Z-MS1.1 68.89,42.62 | Y-MS3.1 v53.65,42.62 | Y-MS2.1 v51.11,42.62 | Y-MS1.1 48.57,42.62 | X-MS3.1 v33.33,42.62 | X-MS1.1 28.25,42.62 | X-MS2.1 v30.79,42.62 | P5.MS3 E-MS6.2 | P5.MS1 E-MS4.2
  Bottom 0.813: v122.23,42.62 v114.61,42.62 v112.07,42.62 109.85,42.62 v101.91,42.62 v94.29,42.62 v91.75,42.62 89.21,42.62 v81.59,42.62 v73.97,42.62 v71.43,42.62 68.89,42.62 v61.27,42.62 v53.65,42.62 v51.11,42.62 48.57,42.62 v40.95,42.62 v33.33,42.62 v30.79,42.62 28.25,42.62
  other vias: 43.49,33.09 113.18,27.3
  pour Layer3_3.3V: 42.86,37.54 130,37.54 130,0 61.27,0 61.27,14.52 66.03,14.52 66.03,12.77 66.67,12.14 69.84,12.14 70.48,12.77 70.48,15.63 74.29,19.44 76.19,19.44 76.19,20.71 73.34,20.71 70.48,17.86 70.48,20.08 69.84,20.71 66.67,20.71 66.03,20.08 66.03,14.84 61.27,14.84 61.27,19.76 42.86,19.76
5V  (via drill 0.6)
  Top 1.27: C13.1 v40.95,14.68 38.41,14.68 37.14,13.41 IC3.3
  Layer3_3.3V 0.406: CN141.5 110.16,1.34 109.53,0.71 42.22,0.71 40.95,1.98 v40.95,14.68
12V  (via drill 0.3, 0.6)
  Top 0.61: D1.1 v25.71,47.7
  Top 1.016: C1.+ v26.98,56.59 28.25,56.59 28.25,55.32 25.71,52.78 P1.VMOT | C2.+ v47.3,56.59 48.57,56.59 48.57,55.32 46.03,52.78 P2.VMOT | C3.+ v67.62,56.59 68.89,56.59 68.89,55.32 66.35,52.78 P3.VMOT | C4.+ v87.94,56.59 89.21,56.59 89.21,55.32 86.67,52.78 P4.VMOT | C5.+ v108.26,56.59 109.53,56.59 109.53,55.32 106.99,52.78 P5.VMOT
  Top 1.27: C6.+ 28.89,33.09 | IC2.1 28.89,19.76 | 28.89,19.76 28.89,28.02 | 28.89,28.02 28.89,33.09 | C7.1 28.89,28.02 | 28.89,33.09 v28.89,35 | IC3.1 30.16,10.23 28.89,11.5 28.89,19.76
  Top 3.81: CN1.3 14.28,38.81 HEATBED.2 6.66,35 5.39,33.73 5.39,15.95 6.66,14.68 HOTEND1.2 | HOTEND0.2 6.66,24.84
  Layer2_GND 2.54: P1.VMOT 23.17,54.05 15.55,54.05 14.28,52.78 CN1.3
  Layer2_GND 3.81: 5.39,24.84 5.39,33.73 6.66,35 HEATBED.2 14.28,38.81 CN1.2 CN1.3 | 5.39,24.84 5.39,15.95 6.66,14.68 HOTEND1.2 | HOTEND0.2 5.39,24.84
  Layer3_3.3V 1.27: CN1.1 17.06,38.17 23.17,38.17 26.34,35 v28.89,35 v28.89,33.73 28.89,4.52 30.16,3.25 FAN.2
  Bottom 2.54: 46.03,46.43 25.71,46.43 v25.71,47.7 P1.VMOT 23.17,54.05 15.55,54.05 14.28,52.78 CN1.3 | 46.03,46.43 66.35,46.43 | 66.35,46.43 86.67,46.43 | 86.67,46.43 106.99,46.43 P5.VMOT | P2.VMOT 46.03,46.43 | P3.VMOT 66.35,46.43 | P4.VMOT 86.67,46.43
  Bottom 3.81: HOTEND1.2 6.66,14.68 5.39,15.95 5.39,26.11 | 5.39,26.11 5.39,33.73 6.66,35 HEATBED.2 14.28,38.81 CN1.1 CN1.2 CN1.3 | 5.39,26.11 6.66,24.84 HOTEND0.2
!E0-EN  (via drill 0.3)
  Top 0.305: IC1.57 100.81,21.84 101.28,22.3 v101.28,36.59
  Bottom 0.305: P4.!EN 88.26,37.22 93.34,37.22 93.97,36.59 v101.28,36.59
!E1-EN  (via drill 0.3)
  Top 0.254: IC1.85 84.36,28.1 v87.31,25.16
  Top 0.305: v105.09,26.43 105.09,35 106.99,36.91 P5.!EN
  Bottom 0.305: v87.31,25.16 92.38,25.16 93.66,26.43 v105.09,26.43
!FAN  (via drill 0.3)
  Top 0.254: IC1.69 86.18,27.84 v86.03,27.7
  Top 0.305: v45.39,11.82 R25.1 | v79.69,25.79 v79.69,28.33
  Bottom 0.254: v79.69,28.33 81.27,28.33 81.91,27.7 v86.03,27.7
  Bottom 0.305: v45.39,11.82 46.03,12.46 46.03,29.29 46.98,30.24 66.35,30.24 69.21,27.38 74.92,27.38 76.51,25.79 v79.69,25.79
!HEATBED  (via drill 0.3)
  Top 0.254: IC1.66 88.49,26.34 v87.94,25.79
  Top 0.305: v25.71,25.48 26.5,25.58 R28.1 | v80.64,27.7 v80.64,25.79
  Bottom 0.305: v25.71,25.48 25.71,29.92 27.93,32.14 67.3,32.14 69.84,29.6 75.56,29.6 77.46,27.7 v80.64,27.7 | v87.94,25.79 v80.64,25.79
!HOTEND0  (via drill 0.3)
  Top 0.254: IC1.68 86.95,27.34 v86.67,27.06
  Top 0.305: v26.34,16.59 26.34,16.48 R26.1
  Bottom 0.305: v26.34,16.59 26.34,29.76 28.09,31.51 66.98,31.51 69.84,28.65 75.56,28.65 77.14,27.06 v86.67,27.06
!HOTEND1  (via drill 0.3)
  Top 0.254: IC1.67 87.72,26.84 v87.31,26.43
  Top 0.305: v26.98,6.43 R27.1
  Bottom 0.305: v26.98,6.43 26.98,29.6 28.25,30.87 66.67,30.87 69.53,28.02 75.24,28.02 76.83,26.43 v87.31,26.43
!RESET  (via drill 0.3)
  Top 0.254: IC1.17 76.29,22.84 v76.51,22.62
  Top 0.305: IC1.17 73.75,22.84 72.7,23.57 R18.1
  Layer3_3.3V 0.254: v76.51,22.62 80.32,22.62 80.95,21.98 80.95,17.86 81.59,17.22 99.37,17.22 100,17.86 100,19.12 103.18,22.3 103.18,39.45 103.81,40.08 127.63,40.08 128.26,40.72 128.26,42.9 | SW1.1 128.26,42.9 | 128.26,42.9 128.26,42.94
!X-EN  (via drill 0.3)
  Top 0.305: IC1.81 86.36,33.72 v86.03,34.05
  Bottom 0.305: v86.03,34.05 73.02,34.05 72.7,33.73 48.25,33.73 45.71,36.27 42.22,36.27 40.95,37.54 26.98,37.54 P1.!EN
!Y-EN  (via drill 0.3)
  Top 0.254: IC1.48 87.86,18.57 v82.54,23.89
  Top 0.305: v69.84,35.63 v69.84,30.55 | v77.78,23.89 v77.78,28.33
  Bottom 0.305: P2.!EN 49.2,35.63 v69.84,35.63 | v69.84,30.55 75.56,30.55 v77.78,28.33 | v82.54,23.89 v77.78,23.89
!Z-EN  (via drill 0.3)
  Top 0.254: IC1.59 86.13,22.84 v83.81,25.16
  Top 0.305: v79.05,25.16 v79.05,28.97 | v71.11,31.82 v71.11,36.91 | v66.35,36.91 P3.!EN
  Bottom 0.254: v79.05,25.16 v83.81,25.16
  Bottom 0.305: v79.05,28.97 76.19,31.82 v71.11,31.82 | v71.11,36.91 v66.35,36.91
AGND  (via drill 0.3, 0.6)
  Top 0.254: IC1.11 76.14,25.84 76.51,25.48 v76.51,24.84 76.51,24.2 76.14,23.84 IC1.15
  Top 0.61: C21.2 v58.73,18.49
  Layer2_GND 0.406: v76.51,24.84 62.86,24.84 58.73,20.39 v58.73,18.49
  Bottom 0.254: GND.2 v58.73,18.49
  pour Bottom (isolate 0.406): 47.43,0.08 47.43,18.81 60.32,18.81 60.32,0.08
  pour Top (isolate 0.406): 47.43,0.08 47.43,18.81 60.32,18.81 60.32,0.08
  pour Layer2_GND: 47.3,18.81 48.57,18.81 58.41,28.65 76.83,28.65 76.83,24.84 62.86,24.84 59.37,21.03 59.37,18.81 60.32,18.81 60.32,0 47.3,0
AVCC  (via drill 0.3, 0.6)
  Top 0.254: IC1.10 71.66,26.34 71.43,26.11 v71.43,25.79 71.43,25.48 71.56,25.34 IC1.12
  Top 0.406: C21.1 55.55,18.7 v55.55,18.49
  Top 0.61: L1.2 53.65,18.49 | 53.65,18.49 C21.1 | R10.1 53.65,17.22 | 53.65,17.22 53.65,18.49 | R12.1 49.84,17.22 53.65,17.22 | R11.1 57.46,17.22 53.65,17.22
  Layer3_3.3V 0.406: v71.43,25.79 61.27,25.79 55.55,20.08 v55.55,18.49
B-THERM  (via drill 0.3)
  Top 0.254: IC1.7 59.19,27.84 v52.38,21.03
  Top 0.61: C11.2 R12.2 v49.84,13.09
  Bottom 0.406: v52.38,21.03 52.54,21.03 52.86,20.71 52.86,16.11 v49.84,13.09
  Bottom 0.61: CN162.1 v49.84,13.09
E0-DIR  (via drill 0.3)
  Top 0.305: IC1.56 94.6,21.34 v94.92,21.03 | v104.45,21.03 P4.DIR
  Bottom 0.305: v94.92,21.03 v104.45,21.03
E0-STEP  (via drill 0.3)
  Top 0.305: IC1.70 92.06,28.34 v93.66,28.33 | v101.91,28.33 P4.STEP
  Bottom 0.305: v93.66,28.33 v101.91,28.33
E0-THERM  (via drill 0.3)
  Top 0.254: v53.65,21.03 59.96,27.34 IC1.8
  Top 0.61: C9.2 R10.2 v53.65,13.09
  Bottom 0.406: v53.65,21.03 v53.65,13.09
  Bottom 0.61: CN160.1 v53.65,13.09
E1-DIR  (via drill 0.3)
  Top 0.254: IC1.50 88.86,19.79 v88.58,20.08 | v103.81,20.08 v103.81,36.59 | v124.77,36.59 P5.DIR
  Bottom 0.254: v88.58,20.08 v103.81,20.08 | v103.81,36.59 v124.77,36.59
E1-STEP  (via drill 0.3)
  Top 0.254: IC1.65 92.12,25.84 v92.38,26.11 | v105.72,27.06 105.72,34.68 v108.26,37.22 | v122.23,37.22 P5.STEP
  Bottom 0.254: v92.38,26.11 93.34,27.06 v105.72,27.06 | v108.26,37.22 v122.23,37.22
E1-THERM  (via drill 0.3)
  Top 0.254: v54.92,21.03 60.73,26.84 IC1.9
  Top 0.61: C10.2 R11.2 v57.46,13.09
  Bottom 0.406: v54.92,21.03 54.76,21.03 54.44,20.71 54.44,16.11 v57.46,13.09
  Bottom 0.61: CN161.1 v57.46,13.09
E-MOT-1A
  Bottom 1.676: P4.1A CN105.3
E-MOT-1A1
  Bottom 1.676: P5.1A CN106.3
E-MOT-1B
  Bottom 1.676: P4.1B CN105.4
E-MOT-1B1
  Bottom 1.676: P5.1B CN106.4
E-MOT-2A
  Bottom 1.676: P4.2A CN105.2
E-MOT-2A1
  Bottom 1.676: P5.2A CN106.2
E-MOT-2B
  Bottom 1.676: P4.2B CN105.1
E-MOT-2B1
  Bottom 1.676: P5.2B CN106.1
E-RESETSLEEP
  Bottom 0.61: P4.!RST P4.!SLP
E-RESETSLEEP1
  Bottom 0.61: P5.!RST P5.!SLP
GND  (via drill 0.3, 0.6)
  Top 0.203: IC1.97 78.36,34.1 78.1,34.37 | IC1.83 85.36,35.59 85.4,35.63
  Top 0.254: C15.2 arc-90 69.16,19.39 X1.2 69.21,17.84 v69.21,17.86 | v73.34,21.03 70.48,18.17 70.48,20.08 69.84,20.71 66.67,20.71 66.03,20.08 66.03,12.77 66.67,12.14 69.84,12.14 70.48,12.77 70.48,15.32 v73.02,17.86 | X1.4 67.3,15.33 v67.3,15.32 67.3,13.51 C14.2 | C23.1 v77.46,12.46
  Bottom 0.254: v69.21,17.86 69.53,18.17
  Bottom 0.406: GND.1 v61.91,18.49
  Bottom 0.813: 69.53,18.17 70.48,18.17 v73.34,21.03
  Bottom 1.27: 41.27,35 v43.49,35
  other vias: 18.73,26.11 21.27,26.11 18.73,15.95 19.99,15.95 21.27,15.95 19.99,26.11 18.73,5.79 19.99,5.79 21.27,5.79 81.59,35.95 75.56,35.95 97.15,19.44 97.07,29.29 84.77,10.55 111.12,25.16 44.76,35 89.33,20.86 79.37,18.25 90.8,32.78 82.22,21.35 73.97,36.59 73.34,35.63 98.73,29.29 89.45,29.36 39.68,35 24.76,30.55 25.08,20.39 25.71,9.92 84.36,18.23 122.91,16.98 127.34,16.98 127.27,8.33 122.91,8.33 128.13,20.79 128.61,34.6 117.82,20.95 113.21,32.22 113.18,25.08 40.95,35 14.6,57.86 2.53,45.16 10.15,45.16 1.9,9.6 1.9,24.84 34.92,35 68.25,1.98 62.54,1.98 64.44,1.98 66.35,1.98 105.72,37.22 115.88,35.63 103.18,56.59 82.86,56.59 62.54,56.59 42.22,56.59 21.9,56.59 82.86,28.33 70.16,21.66 100.64,37.22 101.59,19.12
  pour Top (isolate 0.406, no thermals): 0,60 130,60 130,40.08 41.59,40.08 41.59,18.49 46.35,18.49 46.35,0 0,0
  pour Top (isolate 0.254): 42.86,37.54 130,37.54 130,0 61.27,0 61.27,19.76 42.86,19.76
  pour Bottom (isolate 0.305): 42.86,37.54 130,37.54 130,0 61.27,0 61.27,19.76 42.86,19.76
  pour Bottom (isolate 0.381, rank 2, no thermals): 24.76,40.08 130,40.08 130,60 0,60 0,-0.16 46.35,-0.16 46.35,37.54 24.76,37.54 24.44,37.86 24.44,39.76
  pour Layer2_GND: 42.86,37.54 130,37.54 130,0 61.27,0 61.27,14.52 66.03,14.52 66.03,12.77 66.67,12.14 69.84,12.14 70.48,12.77 70.48,15.63 74.29,19.44 76.19,19.44 76.19,20.71 73.34,20.71 70.48,17.86 70.48,20.08 69.84,20.71 66.67,20.71 66.03,20.08 66.03,14.84 61.27,14.84 61.27,19.76 60,19.76 60,20.39 63.49,24.2 77.46,24.2 77.46,29.29 58.09,29.29 48.57,19.76 42.86,19.76
  pour Layer2_GND (isolate 0.61): 0,60 130,60 130,40.08 24.44,40.08 24.44,37.54 41.59,37.54 41.59,17.22 46.35,17.22 46.35,0 0,0
HEATBED-GND  (via drill 0.6)
  Top 0.406: Q3.MB v20.63,29.92
  Layer2_GND 2.54: HEATBED.1 v20.63,29.92
  Bottom 2.54: HEATBED.1 v20.63,29.92
  other vias: 22.53,31.19 18.73,31.19 18.73,29.29 22.53,29.29
  pour Bottom (isolate 0.254): 17.45,33.73 17.45,27.06 23.8,27.06 23.8,33.73
  pour Layer2_GND (isolate 0.305): 17.45,33.73 17.45,27.06 23.8,27.06 23.8,33.73
  cutout Layer2_GND (isolate 0.254): 16.82,34.37 16.82,26.43 24.44,26.43 24.44,34.37
HOTEND0-GND  (via drill 0.6)
  Top 0.406: Q1.MB v20.63,19.76
  Layer2_GND 2.54: HOTEND0.1 v20.63,19.76
  Bottom 2.54: HOTEND0.1 v20.63,19.76
  other vias: 22.53,19.12 18.73,19.12 18.73,21.03 22.53,21.03
  pour Bottom: 17.45,23.89 23.8,23.89 23.8,16.9 17.45,16.9
  pour Layer2_GND: 17.45,23.89 23.8,23.89 23.8,16.9 17.45,16.9
  cutout Layer2_GND: 16.82,24.52 24.44,24.52 24.44,16.27 16.82,16.27
HOTEND-GND1  (via drill 0.6)
  Top 0.406: Q2.MB v20.63,9.6
  Layer2_GND 2.54: HOTEND1.1 v20.63,9.6
  Bottom 2.54: HOTEND1.1 v20.63,9.6
  other vias: 18.73,8.96 22.53,8.96 22.53,10.87 18.73,10.87
  pour Bottom: 17.45,13.41 23.8,13.41 23.8,6.74 17.45,6.74
  pour Layer2_GND: 17.45,13.41 23.8,13.41 23.8,6.74 17.45,6.74
  cutout Layer2_GND: 16.82,14.05 24.44,14.05 24.44,6.11 16.82,6.11
ISP-BOOT
  Top 0.254: CN131.1 R19.1 93.97,13.83 93.97,18.81 92.94,19.84 IC1.53
LED0
  Top 0.305: LD0.A 128.58,40.4 126.99,40.4 126.36,39.76 125.41,39.76 124.77,40.4 121.28,40.4 120.33,41.35 R4.1
LED1
  Top 0.254: IC1.32 79.86,13.59 77.78,11.5 65.08,11.5 62.54,8.96 R5.2
LED2
  Top 0.254: IC1.33 80.36,13.45 77.78,10.87 66.35,10.87 64.44,8.96 R6.2
LED3
  Top 0.254: IC1.34 80.86,13.32 77.78,10.23 67.62,10.23 66.35,8.96 R7.2
LED4
  Top 0.254: IC1.35 81.36,13.18 77.78,9.6 68.89,9.6 68.25,8.96 R8.2
MISO0  (via drill 0.3)
  Top 0.254: IC1.61 94.66,23.84 v94.92,23.57 | v112.7,15.63 v112.7,10.23
  Bottom 0.254: v94.92,23.57 105.4,23.57 112.7,16.27 v112.7,15.63 | v112.7,10.23 112.7,7.7 113.97,6.43 113.97,5.16 115.25,3.89 CN141.3
MOSI0  (via drill 0.3)
  Top 0.254: IC1.60 93.88,23.34 v94.29,22.94 | v112.07,15 v112.07,10.87
  Bottom 0.254: v94.29,22.94 105.09,22.94 112.07,15.95 v112.07,15 | v112.07,10.87 113.34,10.87 117.78,6.43 CN142.2
N$1
  Bottom 0.813: 60,18.49 61.27,18.49
N$2
  Top 0.254: Q5.3 113.97,18.81 114.61,18.17 114.61,16.9 115.25,16.27 R3.1
N$3  (via drill 0.3)
  Top 0.305: R25.2 R13.1 v42.7,9.6 | v45.71,5.47 Q4.1
  Bottom 0.305: v42.7,9.6 42.7,6.11 43.33,5.47 v45.71,5.47
N$4
  Top 0.305: R14.1 R26.2 22.53,16.59 Q1.4
N$5
  Top 0.813: Q4.3 38.41,6.43 37.14,5.16 FAN.1
N$6
  Top 0.254: CN2.2 120.66,11.84 120.17,11.5 R1.2 118.74,11.48 118.74,9.92 118.42,9.6 C16.1
N$7
  Top 0.254: CN2.3 120.47,12.64 120.01,13.09 118.74,13.09 | C17.1 118.74,14.58 | 118.74,14.58 118.74,13.09 | 118.74,13.09 R2.2 | R3.2 118.74,16.16 118.74,14.58
N$8
  Top 0.254: 22.53,6.43 Q2.4
  Top 0.305: 22.53,6.43 R27.2 R15.1
N$9
  Top 0.254: CN131.5 R9.1
N$10
  Top 0.254: R5.1 LD1.A
N$11
  Top 0.254: R6.1 LD2.A
N$12
  Top 0.254: R7.1 LD3.A
N$13
  Top 0.254: R8.1 LD4.A
N$14
  Top 0.305: R16.1 R28.2 22.53,26.74 Q3.4
P0.26  (via drill 0.3)
  Top 0.254: IC1.6 76.19,28.34 77.14,27.38 77.14,21.98 v77.78,21.35 | v96.19,18.49 96.19,10.23 94.92,8.96 CN144.4
  Bottom 0.254: v77.78,21.35 78.1,21.03 78.1,19.76 78.73,19.12 85.4,19.12 86.35,18.17 92.07,18.17 92.7,18.81 94.29,18.81 94.61,18.49 v96.19,18.49
P1.22  (via drill 0.3)
  Top 0.254: IC1.36 81.86,12.73 v81.59,12.46 | v89.84,11.82 v89.84,1.34 | v100,1.34 CN143.2
  Bottom 0.254: v81.59,12.46 82.22,11.82 v89.84,11.82 | v89.84,1.34 v100,1.34
P1.23  (via drill 0.3)
  Top 0.254: IC1.37 82.36,12.27 v81.59,11.5 | v89.21,11.19 v89.21,7.7 | v96.19,7.7 96.19,4.52 CN143.3
  Bottom 0.254: v81.59,11.5 81.91,11.19 v89.21,11.19 | v89.21,7.7 v96.19,7.7
P1.30  (via drill 0.3)
  Top 0.254: IC1.21 76.38,20.84 v76.83,20.39 | v110.16,15.32 110.16,10.23 113.97,6.43 113.97,5.16 114.61,4.52 118.42,4.52 119.69,3.25 CN141.1
  Bottom 0.254: v76.83,20.39 76.83,17.86 77.78,16.9 91.75,16.9 93.34,15.32 v110.16,15.32
P1.31  (via drill 0.3)
  Top 0.254: IC1.20 76.84,21.34 v77.46,20.71 | v110.8,15.95 110.8,10.55 114.29,7.06 119.37,7.06 120.33,6.11 CN142.1
  Bottom 0.254: v77.46,20.71 77.46,18.49 78.41,17.54 92.07,17.54 93.66,15.95 v110.8,15.95
P2.11
  Top 0.254: IC1.52 92.49,19.34 93.34,18.49 93.34,6.74 93.66,6.43 93.66,5.16 94.92,3.89 CN143.4
P3.25  (via drill 0.3)
  Top 0.254: IC1.27 77.36,16.16 v75.88,14.68 | v90.48,13.09 v90.48,4.52 | v98.73,4.52 CN144.3
  Bottom 0.254: v75.88,14.68 76.83,13.73 82.22,13.73 82.86,13.09 v90.48,13.09 | v90.48,4.52 v98.73,4.52
P3.26  (via drill 0.3)
  Top 0.254: IC1.26 76.86,16.3 75.88,15.32 v75.24,15.32 | v91.11,12.46 v91.11,8.96 | v100,8.96 CN144.2
  Bottom 0.254: v75.24,15.32 75.24,14.36 76.51,13.09 81.91,13.09 82.54,12.46 v91.11,12.46 | v91.11,8.96 v100,8.96
PLAY  (via drill 0.3)
  Top 0.254: R17.1 CN131.6 106.35,12.14 v106.35,17.86 | IC1.51 91.72,18.84 v92.7,17.86
  Bottom 0.254: v92.7,17.86 v106.35,17.86
PLAY-LED  (via drill 0.3)
  Top 0.254: v106.35,27.7 106.35,26.74 105.09,25.48 R9.2 | IC1.82 85.86,28.82 v85.4,28.33
  Bottom 0.254: v106.35,27.7 87.62,27.7 86.99,28.33 v85.4,28.33
RX0  (via drill 0.3)
  Top 0.254: IC1.99 77.36,31.29 78.41,30.24 78.73,30.24 v79.69,29.29 | CN131.4 v102.55,18.49 | v107.31,19.76 v107.31,30.24
  Bottom 0.254: CN131.4 102.55,10.55 | v79.69,29.29 80,28.97 87.31,28.97 88.58,30.24 v107.31,30.24 | v102.55,18.49 104.13,18.49 105.4,19.76 v107.31,19.76
SCK0  (via drill 0.3)
  Top 0.254: IC1.62 95.42,24.34 v95.56,24.2 | v113.34,16.27 v113.34,9.6
  Bottom 0.254: v95.56,24.2 105.72,24.2 113.34,16.59 v113.34,16.27 | v113.34,9.6 113.34,8.33 115.25,6.43 CN142.3
SCL0  (via drill 0.3)
  Top 0.254: IC1.24 76.3,19.34 76.51,19.12 76.51,18.49 v75.24,17.22 | v109.53,14.68 109.53,9.6 112.7,6.43 CN142.4
  Bottom 0.254: v75.24,17.22 76.19,16.27 91.43,16.27 93.02,14.68 v109.53,14.68
SCL1  (via drill 0.3)
  Top 0.254: IC1.47 87.36,15.89 88.58,14.68 v88.58,8.33 | v102.55,8.33 CN144.1
  Bottom 0.254: v88.58,8.33 v102.55,8.33
SD-CS  (via drill 0.3)
  Top 0.305: IC1.79 87.36,34.68 87.94,35.32 v88.26,35.32 | v111.12,35.32 111.12,29.6 111.24,29.48 CN150.2
  Bottom 0.305: v88.26,35.32 v111.12,35.32
SD-MISO  (via drill 0.3)
  Top 0.305: IC1.77 88.36,33.73 88.68,34.05 v89.53,34.05 | CN150.7 110.71,23.98 109.21,25.48 v109.21,34.05
  Bottom 0.305: v89.53,34.05 v109.21,34.05
SD-MOSI  (via drill 0.3)
  Top 0.305: IC1.76 88.86,33.41 v90.16,33.41 | v110.48,33.41 110.48,28.65 110.75,28.38 CN150.3
  Bottom 0.305: v90.16,33.41 v110.48,33.41
SD-SCK  (via drill 0.3)
  Top 0.305: v109.85,34.68 109.85,26.11 v109.92,26.11 | CN150.5 112.46,26.18 v112.39,26.11 | IC1.78 87.86,34.28 88.26,34.68 v88.89,34.68
  Bottom 0.305: v88.89,34.68 v109.85,34.68 | v112.39,26.11 v109.92,26.11
SDA0  (via drill 0.3)
  Top 0.254: v108.9,14.05 108.9,8.96 111.44,6.43 111.44,5.16 112.7,3.89 CN141.4 | IC1.25 74.32,18.84 73.97,18.49 73.97,16.59 74.29,16.27 v75.24,16.27
  Bottom 0.254: v75.24,16.27 75.88,15.63 91.11,15.63 92.7,14.05 v108.9,14.05
SDA1  (via drill 0.3)
  Top 0.254: IC1.46 86.86,15.76 87.94,14.68 v87.94,1.98 | v102.55,1.98 CN143.1
  Bottom 0.254: v87.94,1.98 v102.55,1.98
SSEL0  (via drill 0.3)
  Top 0.254: IC1.63 v96.19,24.84 | v113.97,16.9 v113.97,8.96
  Bottom 0.254: v96.19,24.84 106.04,24.84 v113.97,16.9 | v113.97,8.96 116.52,6.43 116.52,5.16 117.78,3.89 CN141.2
TX0  (via drill 0.3)
  Top 0.254: IC1.98 77.86,31.59 78.57,30.87 79.05,30.87 v80.32,29.6 | CN131.3 100.64,11.5 100.64,19.76 101.91,21.03 101.91,27.38 102.55,28.02 v102.55,30.87
  Bottom 0.254: v102.55,30.87 88.26,30.87 86.99,29.6 v80.32,29.6
USB-D+  (via drill 0.3)
  Top 0.254: IC1.29 78.36,14.73 v78.73,14.36 | R2.1 115.56,13.09 v115.25,12.77
  Bottom 0.254: v78.73,14.36 90.48,14.36 92.07,12.77 v115.25,12.77
USB-D-  (via drill 0.3)
  Top 0.254: IC1.30 78.86,15.19 v79.05,15 | R1.1 v115.88,11.5
  Bottom 0.254: v79.05,15 90.8,15 92.38,13.41 115.88,13.41 v115.88,11.5
USB_CONNECT  (via drill 0.3)
  Top 0.254: IC1.64 95.42,25.34 v95.56,25.48 | v109.21,22.62 109.21,20.08 109.53,19.76 110.02,19.76 Q5.1
  Bottom 0.254: v95.56,25.48 106.35,25.48 v109.21,22.62
X'TAL-IN
  Top 0.254: IC1.22 73.6,20.34 69.84,16.59 68.25,16.59 67.36,17.48 X1.3 67.3,17.84 67.3,19.44 C15.1
X'TAL-OUT
  Top 0.254: C14.1 arc90 69.16,13.46 X1.1 69.59,15.39 74.05,19.84 IC1.23
X-DIR  (via drill 0.3)
  Top 0.305: IC1.80 86.86,34.49 v86.67,34.68
  Bottom 0.305: P1.DIR 44.76,37.54 46.35,37.54 48.89,35 72.7,35 73.02,34.68 v86.67,34.68
X-MAX
  Top 0.254: IC1.39 83.36,11.69 81.91,10.23 79.69,10.23 77.78,8.33 74.61,8.33 73.97,7.7 CN111.1
X-MIN
  Top 0.254: IC1.38 82.86,11.82 81.91,10.87 79.69,10.87 77.78,8.96 72.06,8.96 71.43,8.33 CN110.1
X-MOT-1A
  Bottom 1.676: P1.1A CN101.3
X-MOT-1B
  Bottom 1.676: P1.1B CN101.4
X-MOT-2A
  Bottom 1.676: P1.2A CN101.2
X-MOT-2B
  Bottom 1.676: P1.2B CN101.1
X-RESETSLEEP
  Bottom 0.61: P1.!RST P1.!SLP
X-STEP  (via drill 0.3)
  Top 0.254: IC1.75 87.34,30.84 87.31,30.87 v86.99,30.87
  Top 0.305: v72.38,33.09 v72.38,34.37
  Bottom 0.305: P1.STEP 42.86,36.91 46.03,36.91 48.57,34.37 v72.38,34.37 | v86.99,30.87 79.05,30.87 76.83,33.09 v72.38,33.09
Y-DIR  (via drill 0.3)
  Top 0.254: IC1.49 88.36,19.34 v83.18,24.52
  Top 0.305: v78.41,24.52 v78.41,28.65 | v70.48,31.19 v70.48,36.27 | v63.81,36.27 P2.DIR
  Bottom 0.305: v83.18,24.52 v78.41,24.52 | v78.41,28.65 75.88,31.19 v70.48,31.19 | v70.48,36.27 v63.81,36.27
Y-MAX
  Top 0.254: IC1.43 85.36,15.04 85.72,14.68 85.72,10.55 84.13,8.96 80.32,8.96 79.05,7.7 CN113.1
Y-MIN
  Top 0.254: IC1.40 83.86,11.55 81.91,9.6 79.69,9.6 77.78,7.7 77.14,7.7 CN112.1
Y-MOT-1A
  Bottom 1.676: P2.1A CN102.3
Y-MOT-1B
  Bottom 1.676: P2.1B CN102.4
Y-MOT-2A
  Bottom 1.676: P2.2A CN102.2
Y-MOT-2B
  Bottom 1.676: P2.2B CN102.1
Y-RESETSLEEP
  Bottom 0.61: P2.!RST P2.!SLP
Y-STEP  (via drill 0.3)
  Top 0.254: IC1.74 86.77,30.34 v86.67,30.24
  Top 0.305: v71.75,32.46 v71.75,37.54
  Bottom 0.305: P2.STEP 62.54,37.54 v71.75,37.54 | v86.67,30.24 78.73,30.24 76.51,32.46 v71.75,32.46
Z-DIR  (via drill 0.3)
  Top 0.305: IC1.58 100.36,22.34 100.64,22.62 v100.64,35.95
  Bottom 0.305: P3.DIR 85.4,37.54 86.99,37.54 87.94,36.59 93.02,36.59 93.66,35.95 v100.64,35.95
Z-MAX
  Top 0.254: IC1.45 86.36,15.31 86.99,14.68 86.99,10.55 84.13,7.7 CN115.1
Z-MIN
  Top 0.254: IC1.44 85.86,15.17 86.35,14.68 86.35,10.55 84.13,8.33 82.22,8.33 81.59,7.7 CN114.1
Z-MOT-1A
  Bottom 1.676: CN104.3 CN103.3 P3.1A
Z-MOT-1B
  Bottom 1.676: CN104.4 CN103.4 P3.1B
Z-MOT-2A
  Bottom 1.676: CN104.2 CN103.2 P3.2A
Z-MOT-2B
  Bottom 1.676: CN104.1 CN103.1 P3.2B
Z-RESETSLEEP
  Bottom 0.61: P3.!RST P3.!SLP
Z-STEP  (via drill 0.3)
  Top 0.305: v92.7,35.95 92.7,30.55 91.99,29.84 IC1.73
  Bottom 0.305: P3.STEP 81.91,38.81 83.18,37.54 84.45,37.54 85.08,36.91 86.67,36.91 87.62,35.95 v92.7,35.95
(copper drawn outside any net)
  shapes: Top area x1, Top circle x2

### Text on the board
Top: +
Layer2_GND: Layer2 GND
Layer3_3.3V: Layer3 3.3V
tStop: +
Reference: UNIT: mm | 3.5 | t=1.6
tDocu: X-AXIS | Y-AXIS | Z-AXIS | EXTRUDER0 | EXTRUDER1 | RESET | 1 | BOOT | GND | TX | RX | LED | SW | ISP | PLAY | X-STOP | Y-STOP | Z-STOP | MIN | MAX | MIN | MAX | MIN | MAX | Thermistor | GND | P0.26 | P3.25 | P3.26 | P0.01 | GND | SCL0 | SCK0 | MISO0 | P1.31 | + | + | + | EXT-2 | EXT-1 | Momoinololu M3 | - | - | - | Rev 1.1 | + | FAN | - | NC | P2.11 | P1.23 | P1.22 | P0.00 | 5V | SDA0 | MOSI0 | SSEL0 | P1.30
bDocu: 2B | 2A | 1A | 1B | 2B | 2A | 1A | 1B | 2B | 2A | 1A | 1B | 2B | 2A | 1A | 1B | 2B | 2A | 1A | 1B | X-AXIS | Y-AXIS | Z-AXIS | EXTRUDER0 | EXTRUDER1 | POWER | MS1 | MS2 | MS3 | MS1 | MS2 | MS3 | MS1 | MS2 | MS3 | MS1 | MS2 | MS3 | MS1 | MS2 | MS3 | + | HEATBED | - | + | HOTEND0 | - | + | HOTEND1 | - | Thermistor | X-STOP | Y-STOP | Z-STOP | BED | E0 | E1 | SIG | SIG | + | + | + | + | + | EXT-1 | EXT-2 | Momoinololu M3 | - | - | - | GND | GND | 2015.03.01 | Rev 1.1